# EasyEDA Pro project ReuseBlock_示波器通道_2025-12-05.epro

# Schematic 示波器通道

## Sheets
1 CH1: Create Date: 2024-11-14; Page Name: CH1; Project Name: OSC-chaosheng; Schematic Name: CH1/2; Update Date: 2024-11-22; Company: 嘉立创EDA; Page Size: A4; Version: V1.0
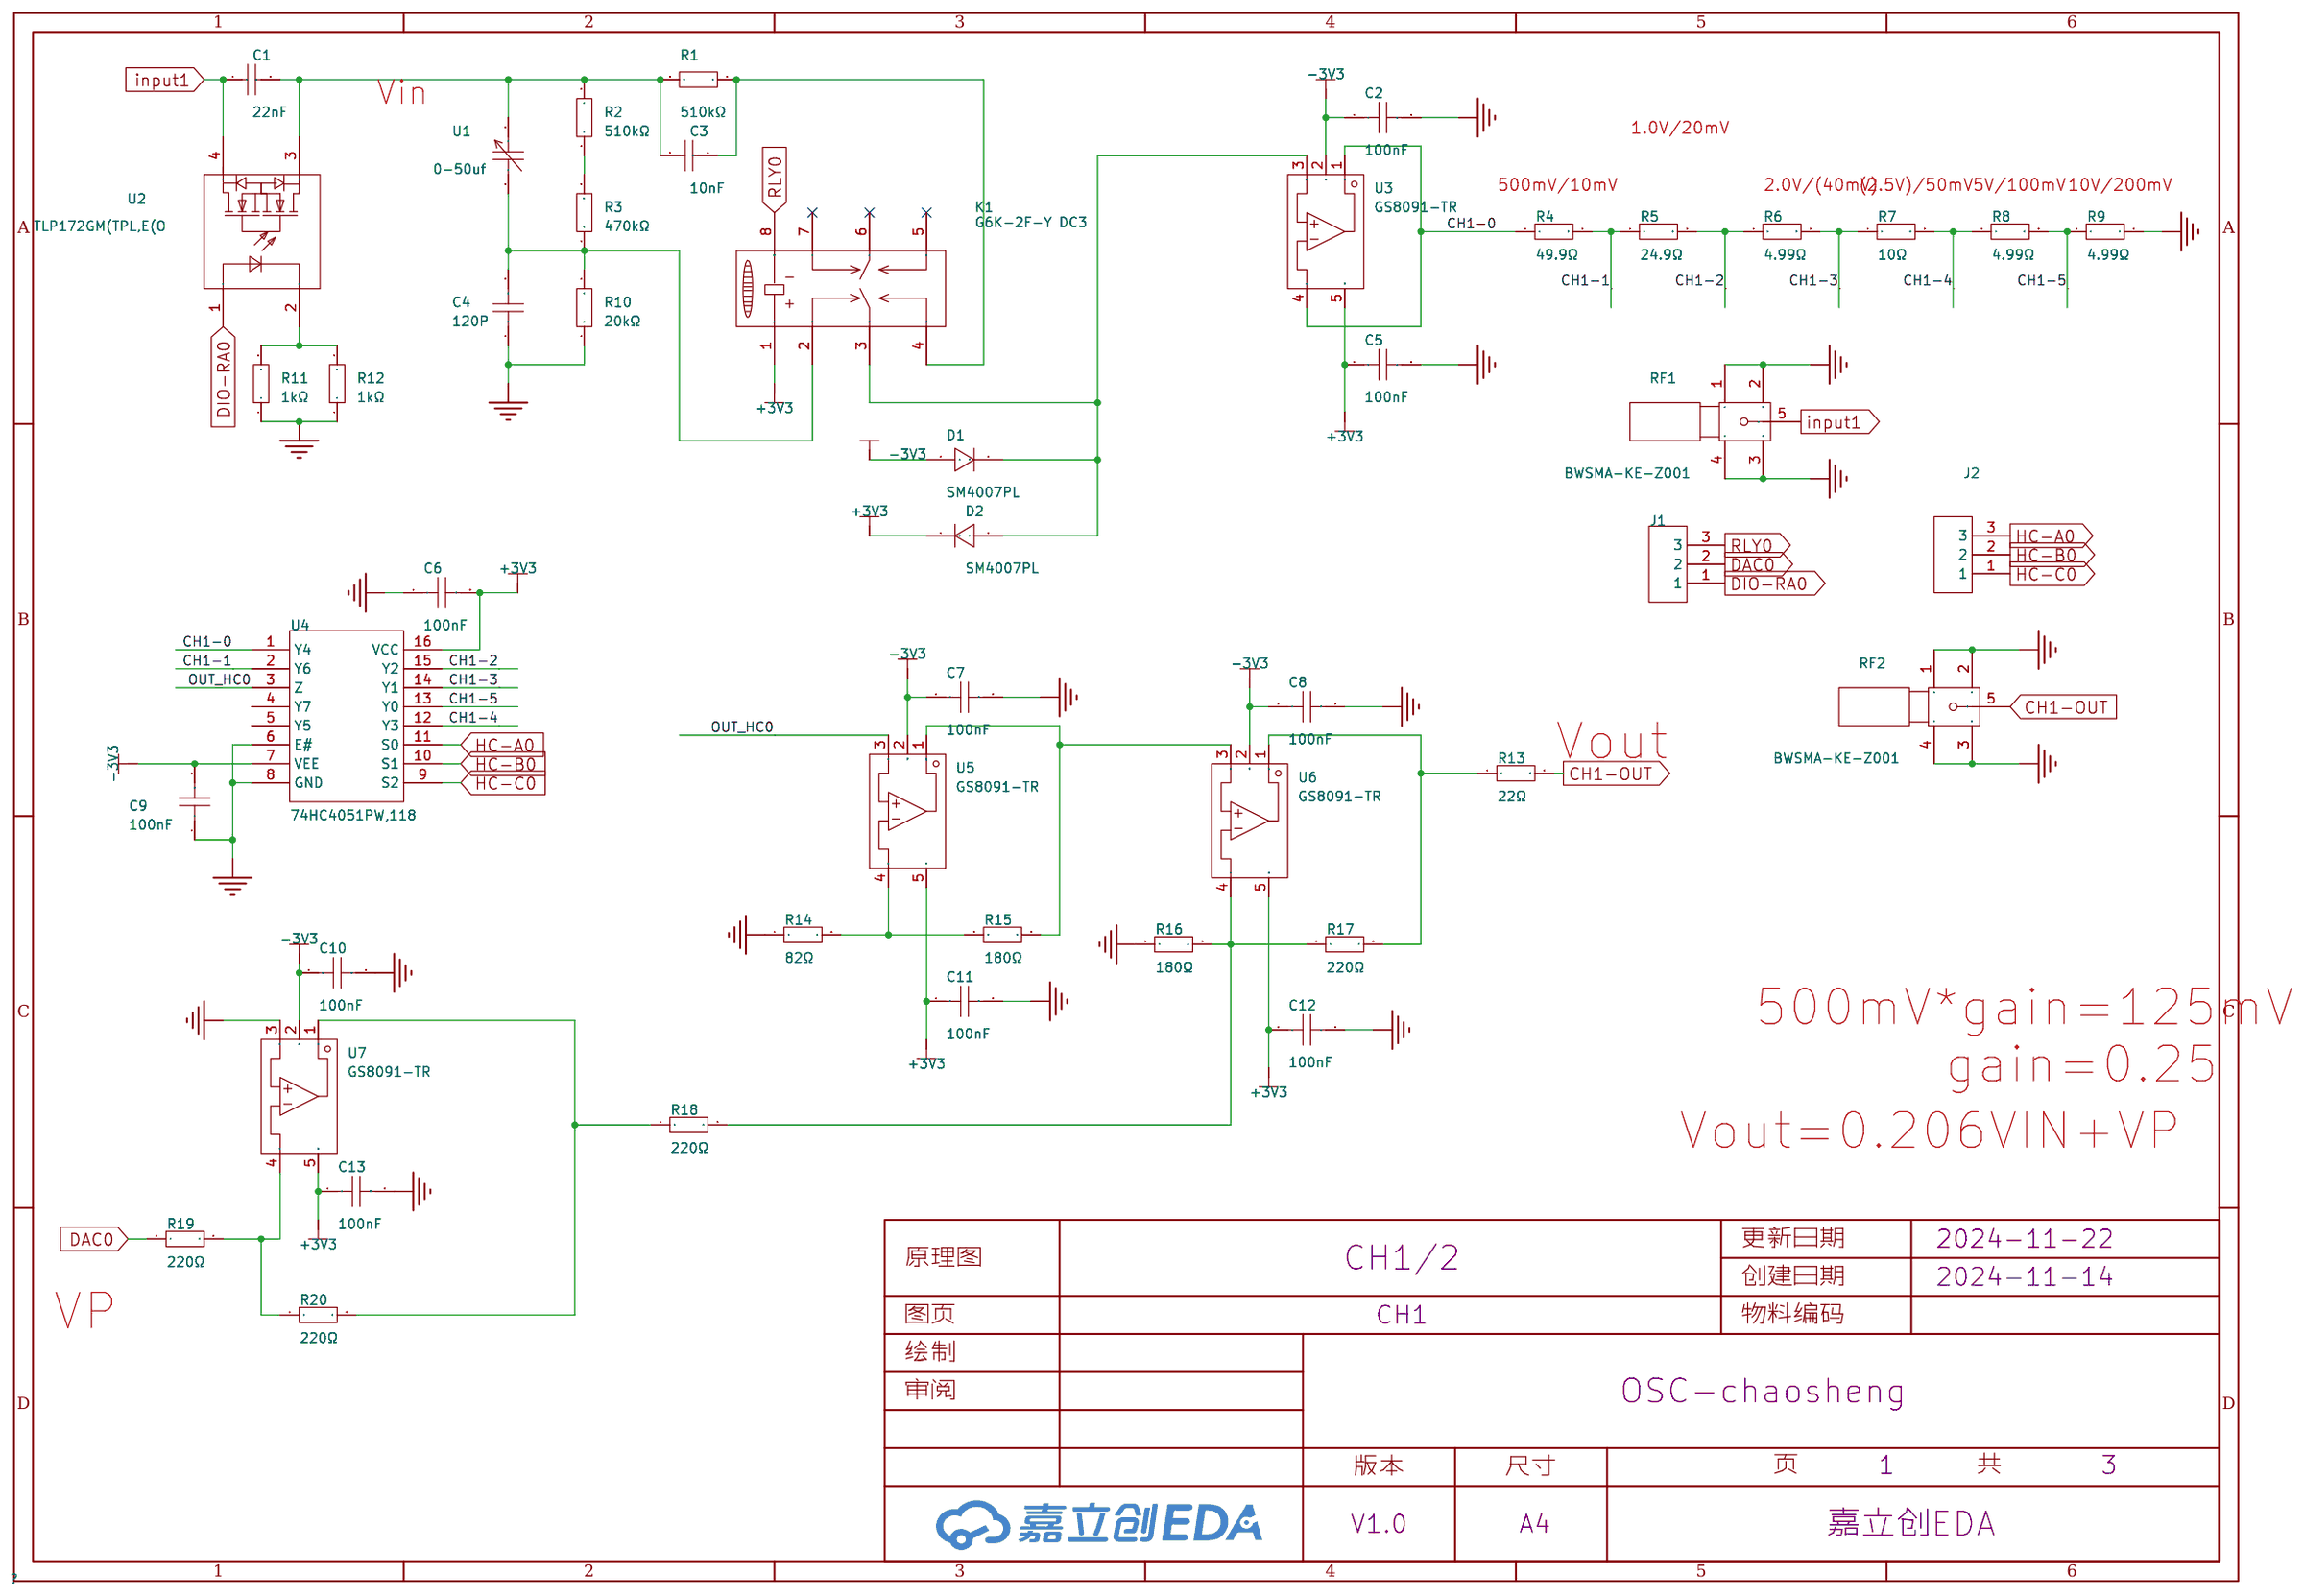
[diagram p0: CH1]
2 CH2: Page Name: CH2; Project Name: OSC1; Schematic Name: CH1/2_1; Update Date: 2024-11-14
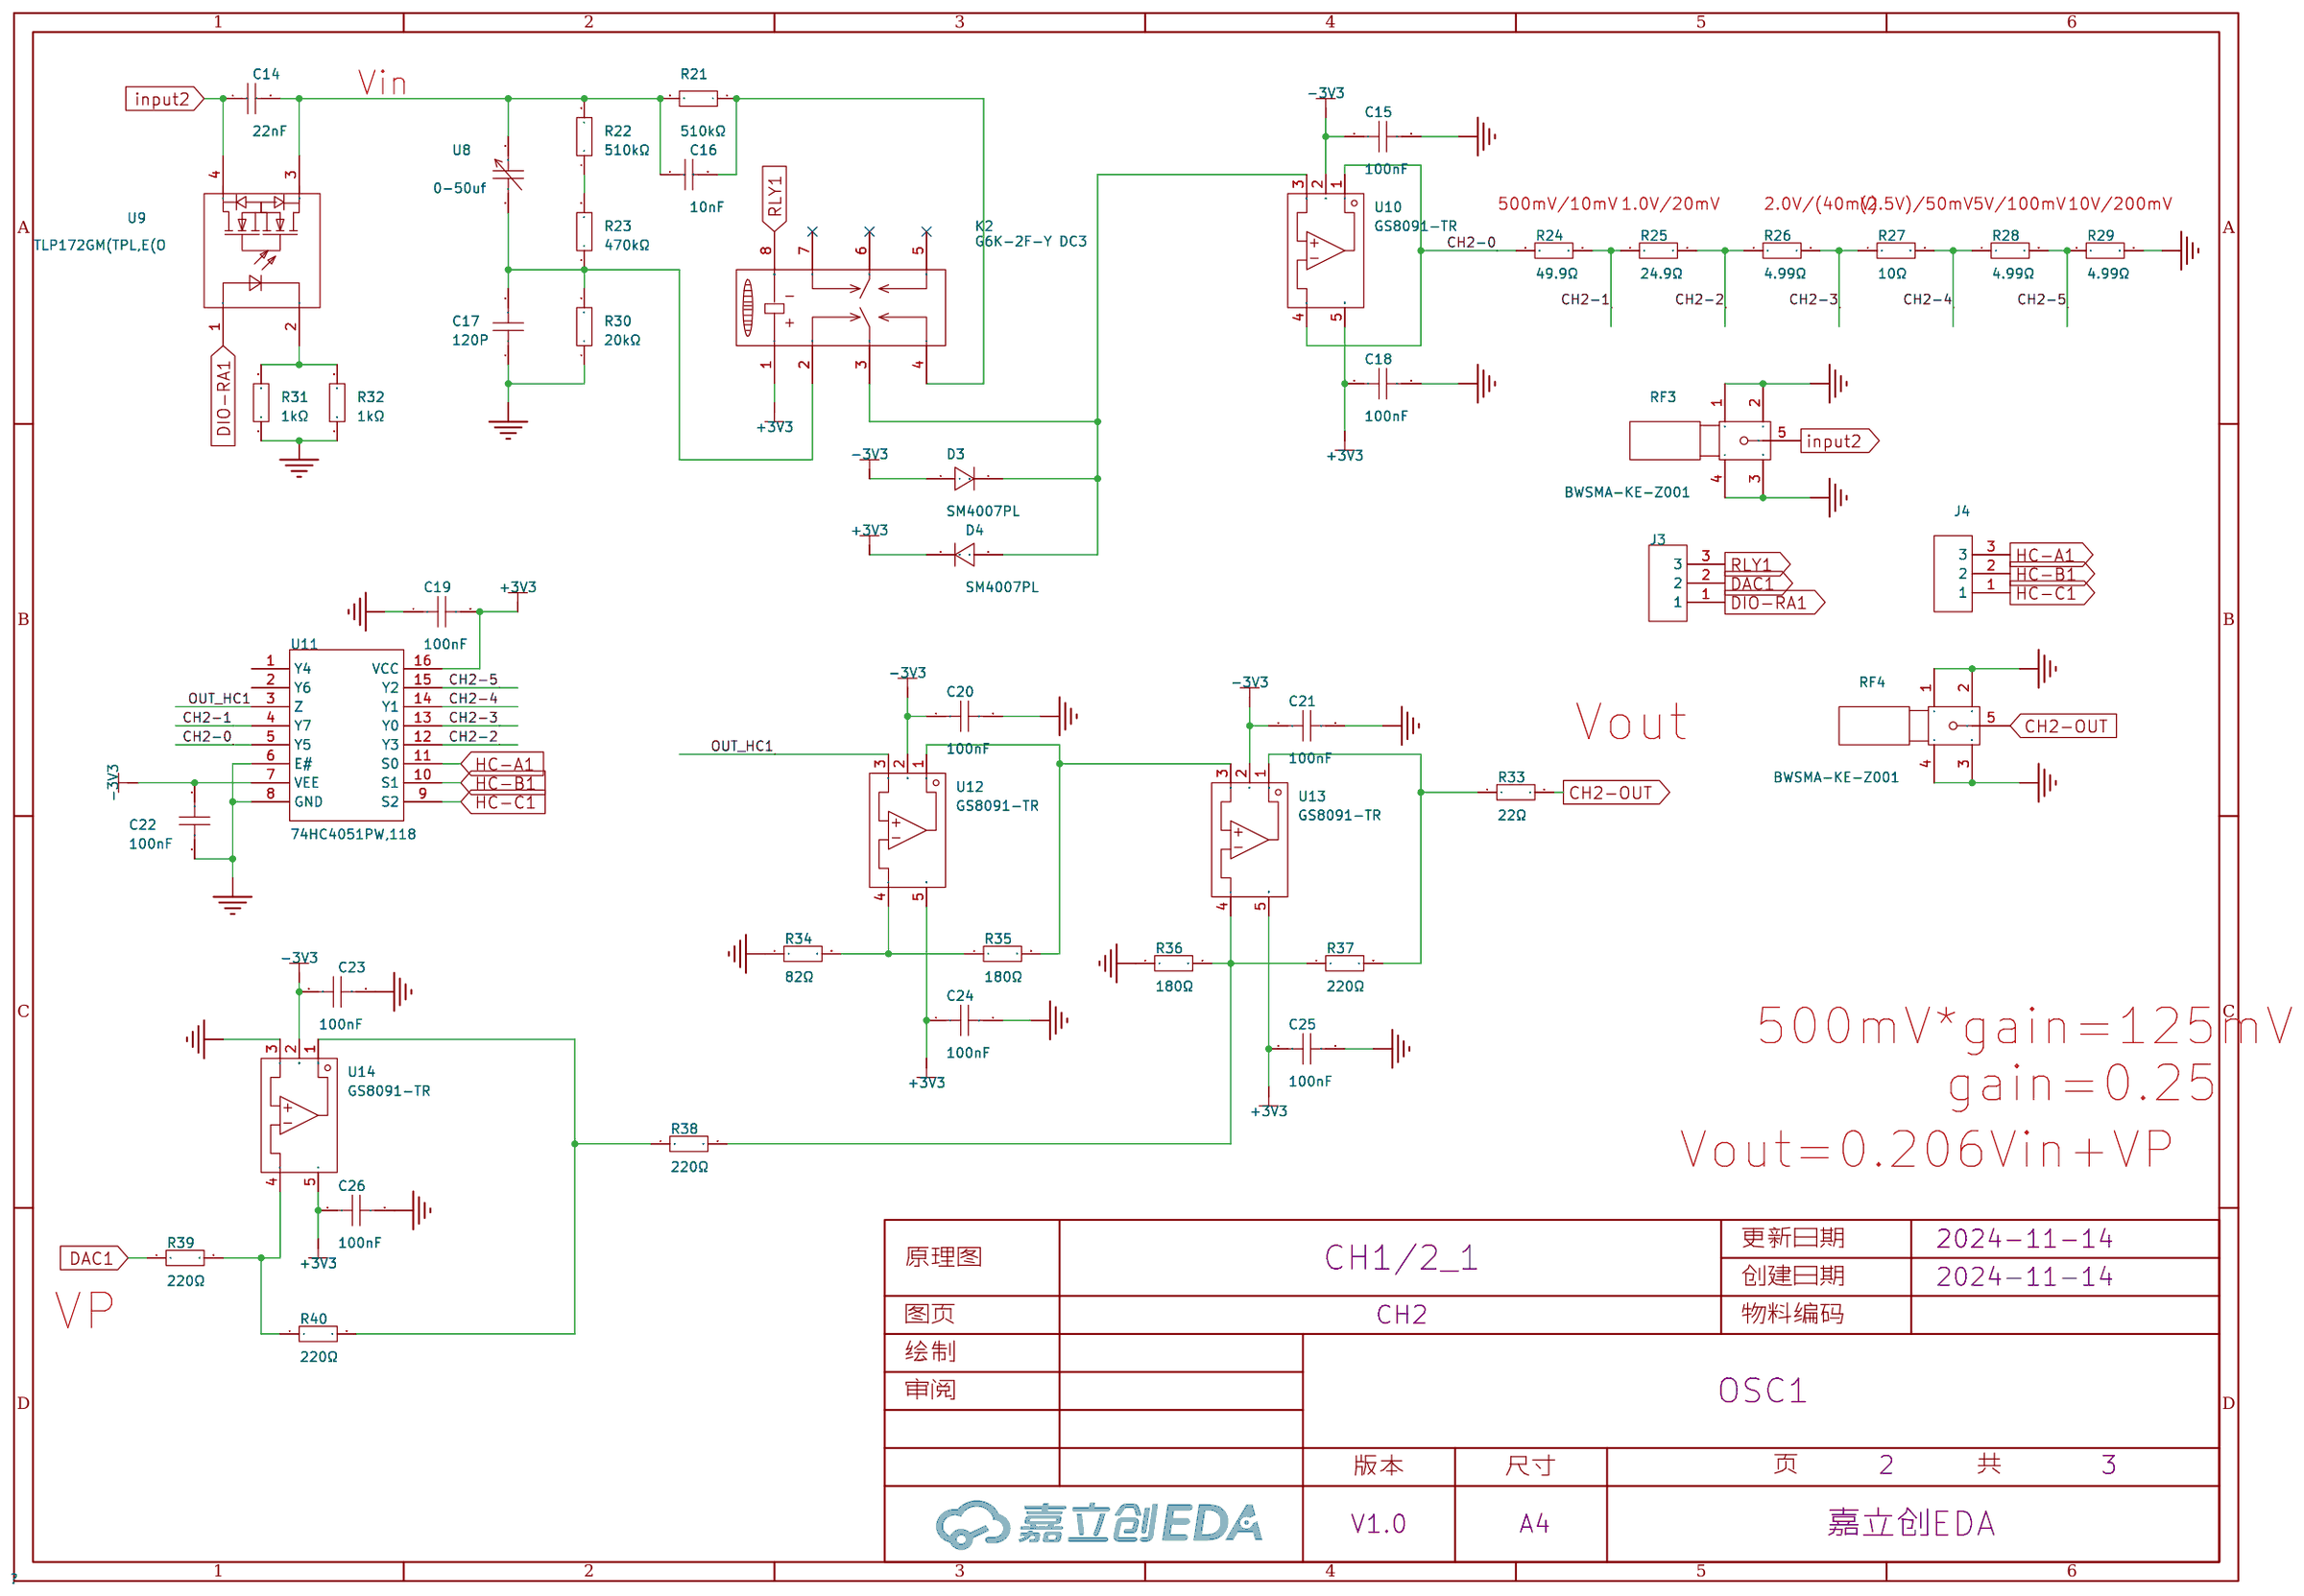
[diagram p1: CH2]
3 电源: Page Name: 电源; Project Name: OSC1; Schematic Name: CH1/2_1; Update Date: 2024-11-14
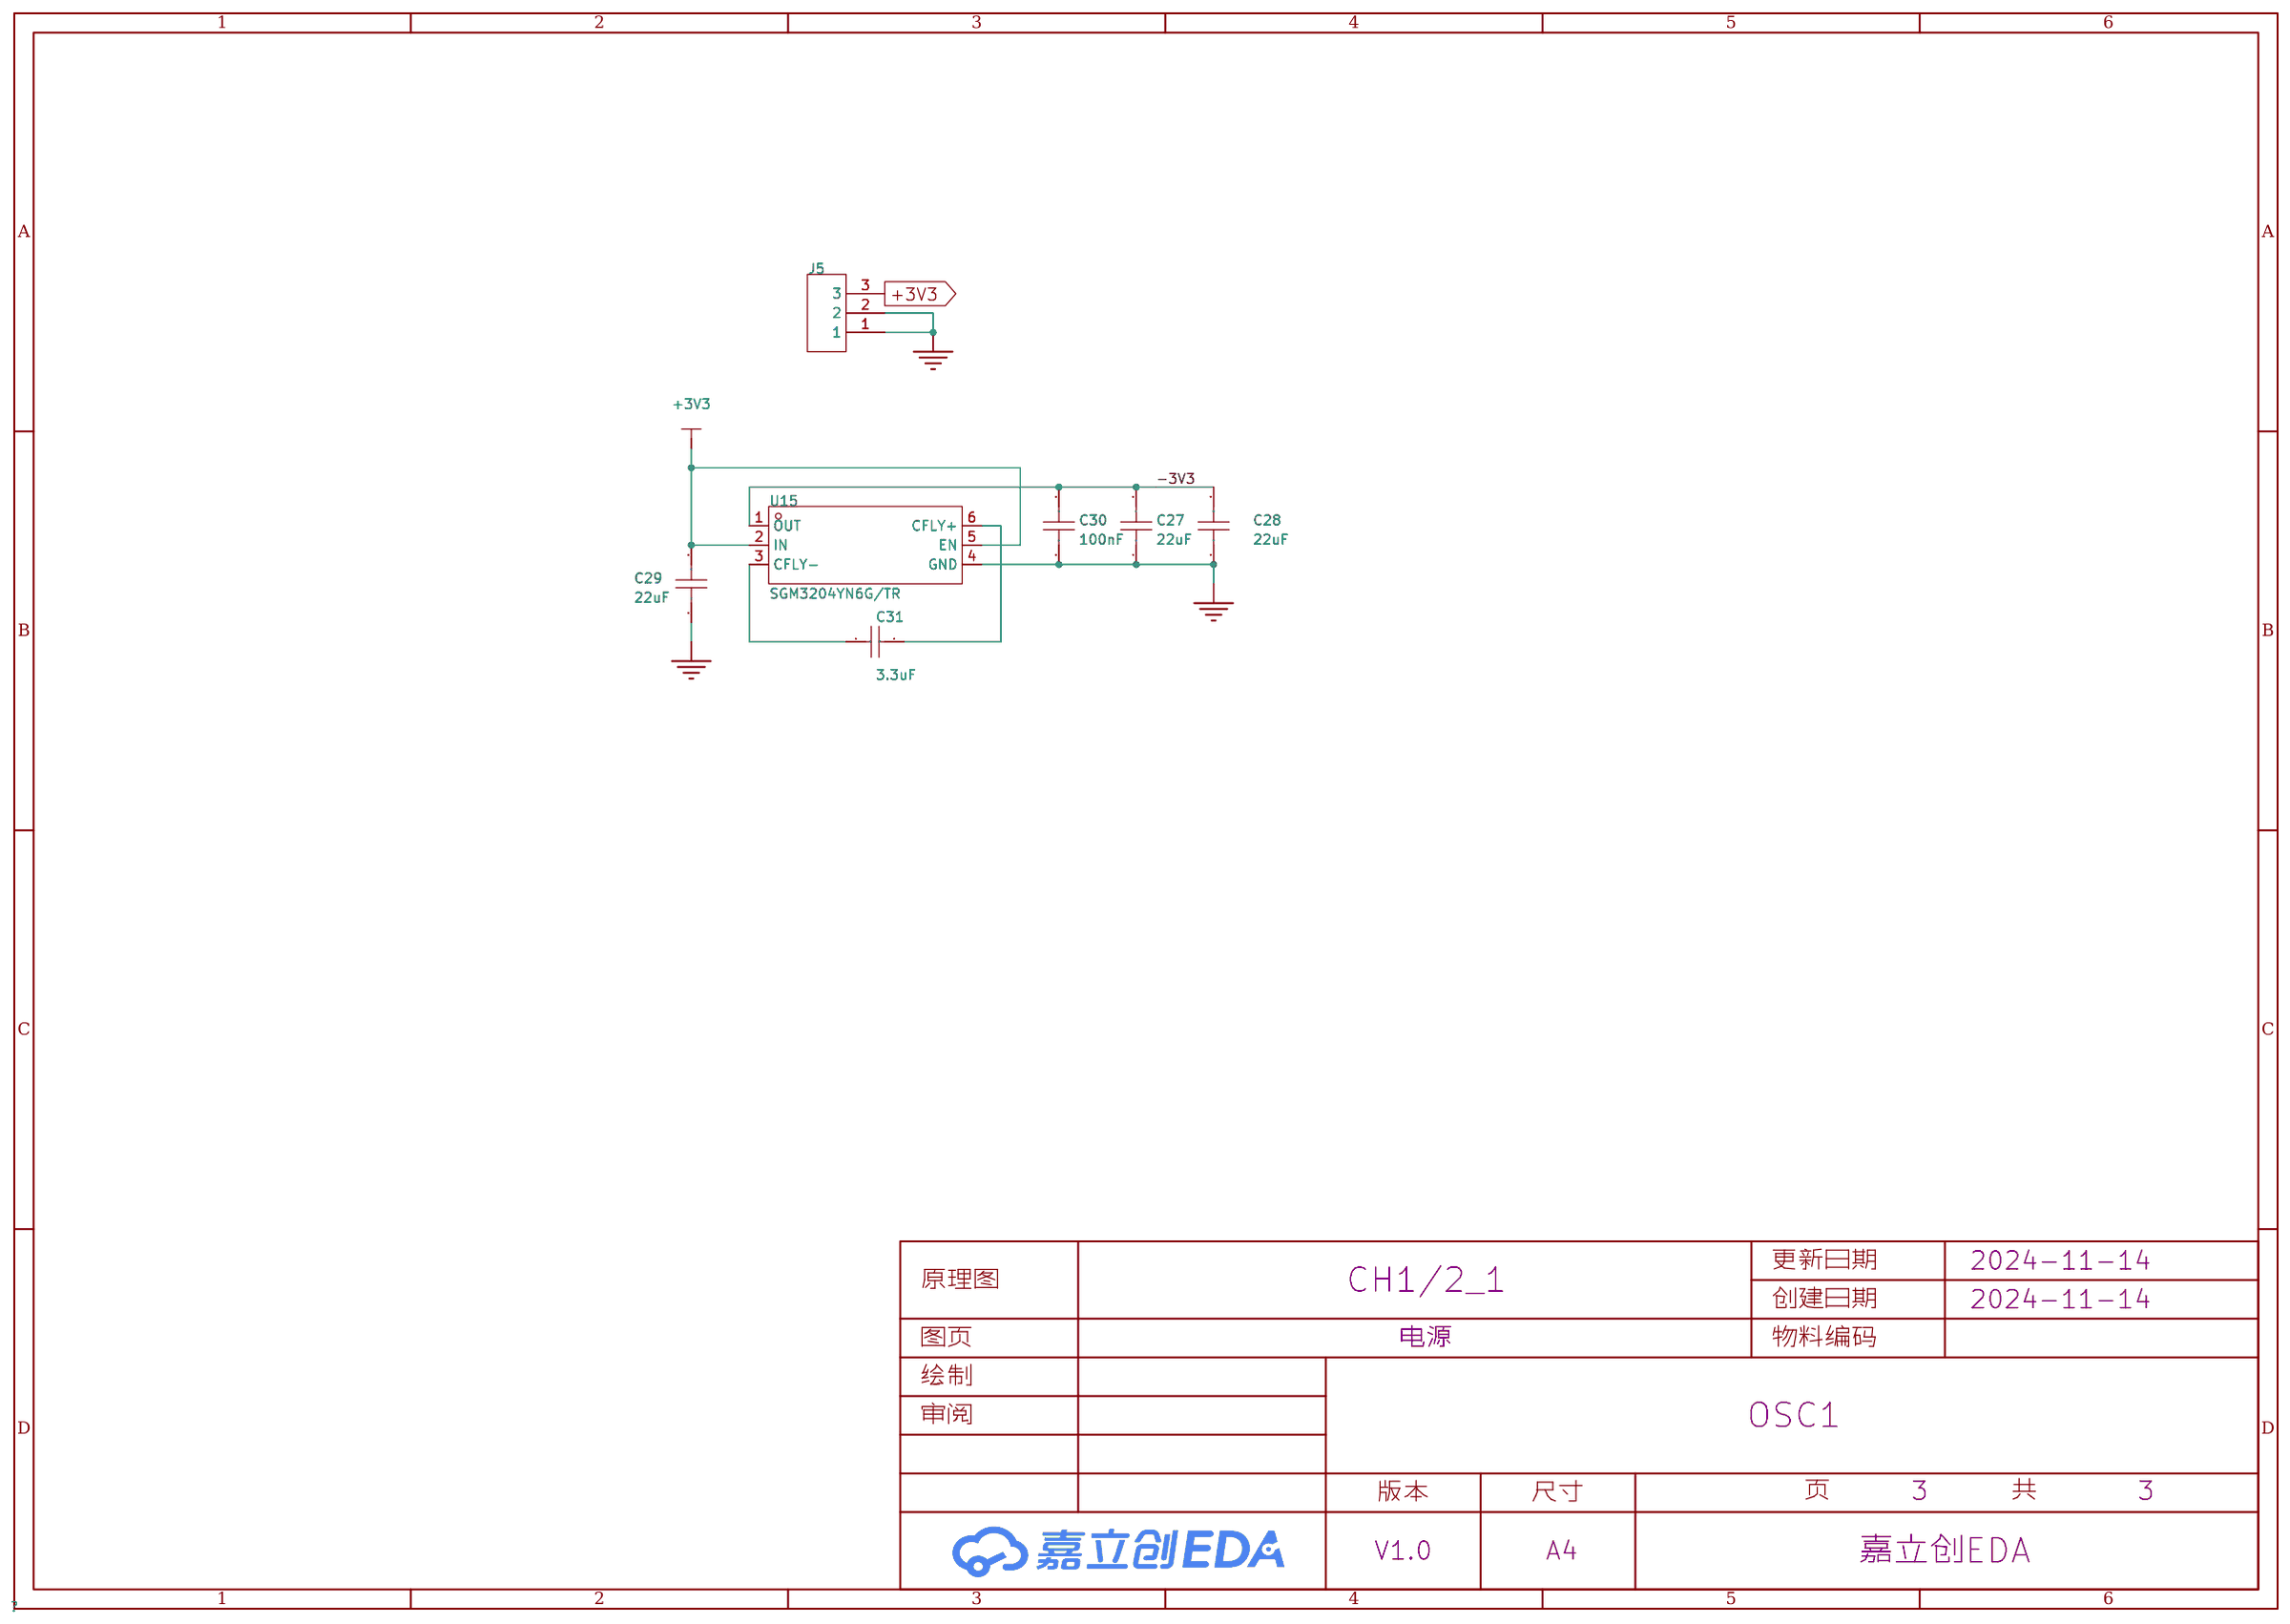
[diagram p2: 电源]

## Parts
sheet CH1
C1  22nF  [C0603]
C2  100nF  [C0402]
C3  10nF  [C0402]
C4  120P  [280*100mil]
C5  100nF  [C0402]
C6  100nF  [C0402]
C7  100nF  [C0402]
C8  100nF  [C0402]
C9  100nF  [C0402]
C10  100nF  [C0402]
C11  100nF  [C0402]
C12  100nF  [C0402]
C13  100nF  [C0402]
D1  SM4007PL  [SOD-123F_L2.8-W1.8-LS3.7-RD]
D2  SM4007PL  [SOD-123F_L2.8-W1.8-LS3.7-RD]
J1  -  [CH2.54-3插座]
J2  -  [CH2.54-3插座]
K1  G6K-2F-Y DC3  [RELAY-SMD_G6K-2F-Y]
R1  510kΩ  [R0402]
R2  510kΩ  [R0402]
R3  470kΩ  [R0402]
R4  49.9Ω  [R0402]
R5  24.9Ω  [R0402]
R6  4.99Ω  [R0402]
R7  10Ω  [R0402]
R8  4.99Ω  [R0402]
R9  4.99Ω  [R0402]
R10  20kΩ  [R0402]
R11  1kΩ  [R0402]
R12  1kΩ  [R0402]
R13  22Ω  [R0402]
R14  82Ω  [R0402]
R15  180Ω  [R0402]
R16  180Ω  [R0402]
R17  220Ω  [R0402]
R18  220Ω  [R0402]
R19  220Ω  [R0402]
R20  220Ω  [R0402]
RF1  BWSMA-KE-Z001  [SMA-TH_BWSMA-KE-Z001]
RF2  BWSMA-KE-Z001  [SMA-TH_BWSMA-KE-Z001]
U1  0-50uf  [可调电容]
U2  TLP172GM(TPL,E(O  [SMD-4_L4.6-W3.7-P2.54-LS7.0-BR]
U3  GS8091-TR  [SOT-23-5_L3.0-W1.7-P0.95-LS2.8-BR]
U4  74HC4051PW,118  [TSSOP-16_L5.0-W4.4-P0.65-LS6.4-BL]
U5  GS8091-TR  [SOT-23-5_L3.0-W1.7-P0.95-LS2.8-BR]
U6  GS8091-TR  [SOT-23-5_L3.0-W1.7-P0.95-LS2.8-BR]
U7  GS8091-TR  [SOT-23-5_L3.0-W1.7-P0.95-LS2.8-BR]
sheet CH2
C14  22nF  [C0603]
C15  100nF  [C0402]
C16  10nF  [C0402]
C17  120P  [280*100mil]
C18  100nF  [C0402]
C19  100nF  [C0402]
C20  100nF  [C0402]
C21  100nF  [C0402]
C22  100nF  [C0402]
C23  100nF  [C0402]
C24  100nF  [C0402]
C25  100nF  [C0402]
C26  100nF  [C0402]
D3  SM4007PL  [SOD-123F_L2.8-W1.8-LS3.7-RD]
D4  SM4007PL  [SOD-123F_L2.8-W1.8-LS3.7-RD]
J3  -  [CH2.54-3插座]
J4  -  [CH2.54-3插座]
K2  G6K-2F-Y DC3  [RELAY-SMD_G6K-2F-Y]
R21  510kΩ  [R0402]
R22  510kΩ  [R0402]
R23  470kΩ  [R0402]
R24  49.9Ω  [R0402]
R25  24.9Ω  [R0402]
R26  4.99Ω  [R0402]
R27  10Ω  [R0402]
R28  4.99Ω  [R0402]
R29  4.99Ω  [R0402]
R30  20kΩ  [R0402]
R31  1kΩ  [R0402]
R32  1kΩ  [R0402]
R33  22Ω  [R0402]
R34  82Ω  [R0402]
R35  180Ω  [R0402]
R36  180Ω  [R0402]
R37  220Ω  [R0402]
R38  220Ω  [R0402]
R39  220Ω  [R0402]
R40  220Ω  [R0402]
RF3  BWSMA-KE-Z001  [SMA-TH_BWSMA-KE-Z001]
RF4  BWSMA-KE-Z001  [SMA-TH_BWSMA-KE-Z001]
U8  0-50uf  [可调电容]
U9  TLP172GM(TPL,E(O  [SMD-4_L4.6-W3.7-P2.54-LS7.0-BR]
U10  GS8091-TR  [SOT-23-5_L3.0-W1.7-P0.95-LS2.8-BR]
U11  74HC4051PW,118  [TSSOP-16_L5.0-W4.4-P0.65-LS6.4-BL]
U12  GS8091-TR  [SOT-23-5_L3.0-W1.7-P0.95-LS2.8-BR]
U13  GS8091-TR  [SOT-23-5_L3.0-W1.7-P0.95-LS2.8-BR]
U14  GS8091-TR  [SOT-23-5_L3.0-W1.7-P0.95-LS2.8-BR]
sheet 电源
C27  22uF  [C0603]
C28  22uF  [C0603]
C29  22uF  [C0603]
C30  100nF  [C0402]
C31  3.3uF  [C0603]
J5  -  [CH2.54-3插座]
U15  SGM3204YN6G/TR  [SOT-23-6_L2.9-W1.6-P0.95-LS2.8-BR]

## Library data of the parts
C1 C14 = CL10B223KB8NNNC: 容值:22nF;精度:±10%;额定电压:50V;材质(温度系数):X7R;; LCSC Part Name: 22nF ±10% 50V; Supplier Part: C21122; Manufacturer: SAMSUNG(三星); Supplier Footprint: 0603; Datasheet: https://atta.szlcsc.com/upload/public/pdf/source/20160218/1457707763339.pdf; Supplier: LCSC; Tolerance: ±10%; Voltage Rated: 50V; Temperature Coefficient: X7R
C2 C5-C13 C15 C18-C26 = CL05B104KB54PNC: 容值:100nF;精度:±10%;额定电压:50V;材质(温度系数):X7R;; LCSC Part Name: 100nF ±10% 50V; Supplier Part: C307331; Manufacturer: SAMSUNG(三星); Supplier Footprint: 0402; JLCPCB Part Class: 基础库; Datasheet: https://atta.szlcsc.com/upload/public/pdf/source/20160218/1457707763339.pdf; Supplier: LCSC; Tolerance: ±10%; Voltage Rated: 50V; Temperature Coefficient: X7R
C3 C16 = CL05B103KB5NNNC: 容值:10nF;精度:±10%;额定电压:50V;材质(温度系数):X7R;; LCSC Part Name: 10nF ±10% 50V; Supplier Part: C15195; Manufacturer: SAMSUNG(三星); Supplier Footprint: 0402; Datasheet: https://atta.szlcsc.com/upload/public/pdf/source/20160218/1457707763339.pdf; Supplier: LCSC; Tolerance: ±10%; Voltage Rated: 50V; Temperature Coefficient: X7R
C4 C17 = 插件电容
D1-D4 = SM4007PL_C64898: 二极管配置:独立式;正向压降(Vf):1.1V@1A;直流反向耐压(Vr):1kV;整流电流:1A;; LCSC Part Name: 电压:1kV 电流:1A; Supplier Part: C64898; Manufacturer: MDD(辰达半导体); Supplier Footprint: SOD-123FL; Datasheet: https://atta.szlcsc.com/upload/public/pdf/source/20230823/16A8FDE162764C9B685A3717F2DA3690.pdf; Supplier: LCSC; Diode Configuration: 独立式; Forward Voltage (Vf@If): 1.1V@1A; Reverse Voltage (Vr): 1kV; Rectified Current: 1A; Reverse Leakage Current: 10uA@1kV
J1-J5 = HDR-3P
K1 K2 = G6K-2F-Y DC3: 线圈电压:-;触点形式:-;触点容量(电阻负载):-;最大切换电压:-;最大切换电流:-;; LCSC Part Name: G6K-2F-Y 3VDC; Supplier Part: C93168; Manufacturer: OMRON(欧姆龙); Supplier Footprint: SMD,6.5x10mm; JLCPCB Part Class: 扩展库; Datasheet: https://atta.szlcsc.com/upload/public/pdf/source/20220125/C1876770_53E5491D4B68F29C4BBD8118E9BAE0E8.pdf; Supplier: LCSC
R1 R2 R21 R22 = 0402WGF5103TCE: 电阻类型:厚膜电阻;阻值:510kΩ;精度:±1%;功率:62.5mW;最大工作电压:50V;温度系数:±100ppm/℃;; LCSC Part Name: 510kΩ ±1% 62.5mW 厚膜电阻; Supplier Part: C11616; Manufacturer: UNI-ROYAL(厚声); Supplier Footprint: 0402; Datasheet: https://atta.szlcsc.com/upload/public/pdf/source/20200306/C422600_1E6D84923E4A46A82E41ADD87F860B5C.pdf; Supplier: LCSC; Type: 厚膜电阻; Tolerance: ±1%; Power(Watts): 62.5mW; Overload Voltage (Max): 50V; Temperature Coefficient: ±100ppm/℃; Operating Temperature Range: -55℃~+155℃
R3 R23 = 0402WGF4703TCE: 电阻类型:厚膜电阻;阻值:470kΩ;精度:±1%;功率:62.5mW;最大工作电压:50V;温度系数:±100ppm/℃;; LCSC Part Name: 470kΩ ±1% 62.5mW 厚膜电阻; Supplier Part: C25790; Manufacturer: UNI-ROYAL(厚声); Supplier Footprint: 0402; Datasheet: https://atta.szlcsc.com/upload/public/pdf/source/20200306/C422600_1E6D84923E4A46A82E41ADD87F860B5C.pdf; Supplier: LCSC; Type: 厚膜电阻; Tolerance: ±1%; Power(Watts): 62.5mW; Overload Voltage (Max): 50V; Temperature Coefficient: ±100ppm/℃; Operating Temperature Range: -55℃~+155℃
R4 R24 = 0402WGF499JTCE: 电阻类型:厚膜电阻;阻值:49.9Ω;精度:±1%;功率:62.5mW;最大工作电压:50V;温度系数:±100ppm/℃;; LCSC Part Name: 49.9Ω ±1% 62.5mW 厚膜电阻; Supplier Part: C25120; Manufacturer: UNI-ROYAL(厚声); Supplier Footprint: 0402; JLCPCB Part Class: 基础库; Datasheet: https://atta.szlcsc.com/upload/public/pdf/source/20200306/C422600_1E6D84923E4A46A82E41ADD87F860B5C.pdf; Supplier: LCSC; Type: 厚膜电阻; Tolerance: ±1%; Power(Watts): 62.5mW; Overload Voltage (Max): 50V; Temperature Coefficient: ±100ppm/℃; Operating Temperature Range: -55℃~+155℃
R5 R25 = 0402WGF249JTCE: 电阻类型:厚膜电阻;阻值:24.9Ω;精度:±1%;功率:62.5mW;最大工作电压:50V;温度系数:±200ppm/℃;; LCSC Part Name: 24.9Ω ±1% 62.5mW 厚膜电阻; Supplier Part: C5099; Manufacturer: UNI-ROYAL(厚声); Supplier Footprint: 0402; JLCPCB Part Class: 扩展库; Datasheet: https://atta.szlcsc.com/upload/public/pdf/source/20200306/C422600_1E6D84923E4A46A82E41ADD87F860B5C.pdf; Supplier: LCSC; Type: 厚膜电阻; Tolerance: ±1%; Power(Watts): 62.5mW; Overload Voltage (Max): 50V; Temperature Coefficient: ±200ppm/℃; Operating Temperature Range: -55℃~+155℃
R6 R8 R9 R26 R28 R29 = 0402WGF499KTCE: 电阻类型:厚膜电阻;阻值:4.99Ω;精度:±1%;功率:62.5mW;最大工作电压:50V;温度系数:±400ppm/℃;; LCSC Part Name: 4.99Ω ±1% 62.5mW 厚膜电阻; Supplier Part: C25122; Manufacturer: UNI-ROYAL(厚声); Supplier Footprint: 0402; JLCPCB Part Class: 扩展库; Datasheet: https://atta.szlcsc.com/upload/public/pdf/source/20200306/C422600_1E6D84923E4A46A82E41ADD87F860B5C.pdf; Supplier: LCSC; Type: 厚膜电阻; Tolerance: ±1%; Power(Watts): 62.5mW; Overload Voltage (Max): 50V; Temperature Coefficient: ±400ppm/℃; Operating Temperature Range: -55℃~+155℃
R7 R27 = 0402WGF100JTCE: 电阻类型:厚膜电阻;阻值:10Ω;精度:±1%;功率:62.5mW;最大工作电压:50V;温度系数:±200ppm/℃;; LCSC Part Name: 10Ω ±1% 62.5mW 厚膜电阻; Supplier Part: C25077; Manufacturer: UNI-ROYAL(厚声); Supplier Footprint: 0402; Datasheet: https://atta.szlcsc.com/upload/public/pdf/source/20200306/C422600_1E6D84923E4A46A82E41ADD87F860B5C.pdf; Supplier: LCSC; Type: 厚膜电阻; Tolerance: ±1%; Power(Watts): 62.5mW; Overload Voltage (Max): 50V; Temperature Coefficient: ±200ppm/℃; Operating Temperature Range: -55℃~+155℃
R10 R30 = 0402WGF2002TCE: 电阻类型:厚膜电阻;阻值:20kΩ;精度:±1%;功率:62.5mW;最大工作电压:50V;温度系数:±100ppm/℃;; LCSC Part Name: 20kΩ ±1% 62.5mW 厚膜电阻; Supplier Part: C25765; Manufacturer: UNI-ROYAL(厚声); Supplier Footprint: 0402; Datasheet: https://atta.szlcsc.com/upload/public/pdf/source/20200306/C422600_1E6D84923E4A46A82E41ADD87F860B5C.pdf; Supplier: LCSC; Type: 厚膜电阻; Tolerance: ±1%; Power(Watts): 62.5mW; Overload Voltage (Max): 50V; Temperature Coefficient: ±100ppm/℃; Operating Temperature Range: -55℃~+155℃
R11 R12 R31 R32 = 0402WGF1001TCE: 电阻类型:厚膜电阻;阻值:1kΩ;精度:±1%;功率:62.5mW;最大工作电压:50V;温度系数:±100ppm/℃;; LCSC Part Name: 1kΩ ±1% 62.5mW 厚膜电阻; Supplier Part: C11702; Manufacturer: UNI-ROYAL(厚声); Supplier Footprint: 0402; Datasheet: https://atta.szlcsc.com/upload/public/pdf/source/20200306/C422600_1E6D84923E4A46A82E41ADD87F860B5C.pdf; Supplier: LCSC; Type: 厚膜电阻; Tolerance: ±1%; Power(Watts): 62.5mW; Overload Voltage (Max): 50V; Temperature Coefficient: ±100ppm/℃; Operating Temperature Range: -55℃~+155℃
R13 R33 = 0402WGF220JTCE: 电阻类型:厚膜电阻;阻值:22Ω;精度:±1%;功率:62.5mW;最大工作电压:50V;温度系数:±100ppm/℃;; LCSC Part Name: 22Ω ±1% 62.5mW 厚膜电阻; Supplier Part: C25092; Manufacturer: UNI-ROYAL(厚声); Supplier Footprint: 0402; JLCPCB Part Class: 基础库; Datasheet: https://atta.szlcsc.com/upload/public/pdf/source/20200306/C422600_1E6D84923E4A46A82E41ADD87F860B5C.pdf; Supplier: LCSC; Type: 厚膜电阻; Tolerance: ±1%; Power(Watts): 62.5mW; Overload Voltage (Max): 50V; Temperature Coefficient: ±100ppm/℃; Operating Temperature Range: -55℃~+155℃
R14 R34 = 0402WGF820JTCE: 电阻类型:厚膜电阻;阻值:82Ω;精度:±1%;功率:62.5mW;最大工作电压:50V;温度系数:±200ppm/℃;; LCSC Part Name: 82Ω ±1% 62.5mW 厚膜电阻; Supplier Part: C25136; Manufacturer: UNI-ROYAL(厚声); Supplier Footprint: 0402; JLCPCB Part Class: 扩展库; Datasheet: https://atta.szlcsc.com/upload/public/pdf/source/20200306/C422600_1E6D84923E4A46A82E41ADD87F860B5C.pdf; Supplier: LCSC; Type: 厚膜电阻; Tolerance: ±1%; Power(Watts): 62.5mW; Overload Voltage (Max): 50V; Temperature Coefficient: ±200ppm/℃; Operating Temperature Range: -55℃~+155℃
R15 R16 R35 R36 = 0402WGF1800TCE: 电阻类型:厚膜电阻;阻值:180Ω;精度:±1%;功率:62.5mW;最大工作电压:50V;温度系数:±100ppm/℃;; LCSC Part Name: 180Ω ±1% 62.5mW 厚膜电阻; Supplier Part: C38941; Manufacturer: UNI-ROYAL(厚声); Supplier Footprint: 0402; JLCPCB Part Class: 扩展库; Datasheet: https://atta.szlcsc.com/upload/public/pdf/source/20200306/C422600_1E6D84923E4A46A82E41ADD87F860B5C.pdf; Supplier: LCSC; Type: 厚膜电阻; Tolerance: ±1%; Power(Watts): 62.5mW; Overload Voltage (Max): 50V; Temperature Coefficient: ±100ppm/℃; Operating Temperature Range: -55℃~+155℃
R17-R20 R37-R40 = 0402WGF2200TCE: 电阻类型:厚膜电阻;阻值:220Ω;精度:±1%;功率:62.5mW;最大工作电压:50V;温度系数:±100ppm/℃;; LCSC Part Name: 220Ω ±1% 62.5mW 厚膜电阻; Supplier Part: C25091; Manufacturer: UNI-ROYAL(厚声); Supplier Footprint: 0402; JLCPCB Part Class: 基础库; Datasheet: https://atta.szlcsc.com/upload/public/pdf/source/20200306/C422600_1E6D84923E4A46A82E41ADD87F860B5C.pdf; Supplier: LCSC; Type: 厚膜电阻; Tolerance: ±1%; Power(Watts): 62.5mW; Overload Voltage (Max): 50V; Temperature Coefficient: ±100ppm/℃; Operating Temperature Range: -55℃~+155℃
RF1-RF4 = BWSMA-KE-Z001_C496549: 连接器类型:板端;接口类型:内孔;端口数量:1;接口直径:-;接口长度/高度:-;频率-最大值:-;射频系列:SMA;阻抗:50Ω;样式:正脚;触头材质:-;触头镀层:-;工作温度范围:-65℃~+165℃;焊接温度(最大值):-;; LCSC Part Name: 内孔 SMA 正脚; Supplier Part: C496549; Manufacturer: BAT WIRELESS(蝙蝠无线); Supplier Footprint: 插件; Datasheet: https://atta.szlcsc.com/upload/public/pdf/source/20221228/40BF41E56A06003A0210E1785CA66EA6.pdf; Supplier: LCSC; Connector Type: 板端; Interface Type: 内孔; Number of Ports: 1; RF Series: SMA; Impedance: 50Ω; Style: 正脚; Operating Temperature Range: -65℃~+165℃
U1 U8 = 0-50uf可调电容
U2 U9 = TLP172GM(TPL,E(O: 继电器触点形式:1 Form A(SPST-NO);适用负载类型:AC,DC;正向压降:1.27V;负载电压:350V;连续负载电流:110mA;导通电阻:22Ω;; LCSC Part Name: 1 Form A(SPSTNO) 负载AC,DC 负载电压350V; Supplier Part: C261926; Manufacturer: TOSHIBA(东芝); Supplier Footprint: SOP-4-2.54mm; Datasheet: https://atta.szlcsc.com/upload/public/pdf/source/20180801/C261926_98E6F8A0917C7E31AE8EC16F9B9F81C3.pdf; Supplier: LCSC; Relay Contact Form: 1 Form A(SPST-NO); Load Type: AC,DC; Input Forward Voltage: 1.27V; Voltage - Load: 350V; Continuous Load Current: 110mA; On Resistance: 22Ω; Isolation Voltage(rms): 3.75kV; Turn-on time: 500us; Turn-off time: 100us
U3 U5-U7 U10 U12-U14 = GS8091-TR: 放大器数:单路;增益带宽积(GBP):180MHz;输入偏置电流(Ib):1pA;输入失调电压(Vos):2mV;压摆率(SR):206V/us;带宽(-3db):350MHz;; LCSC Part Name: GS8091 SOT-23-5; Supplier Part: C157724; Manufacturer: Gainsil(聚洵); Supplier Footprint: SOT-23-5; JLCPCB Part Class: 扩展库; Datasheet: https://atta.szlcsc.com/upload/public/pdf/source/20220610/E3748DDE2830B859623FB1BDA24ABCCF.pdf; Supplier: LCSC; Number of Circuits: 单路; Gain Bandwidth Product(GBP): 180MHz; Current - Input Bias(Ib): 1pA; Voltage - Input Offset(Vos): 2mV; Slew Rate(SR): 206V/us; Supply Voltage: -；-；-; -3db Bandwidth: 350MHz; Supply Current: 4.2mA
U4 U11 = 74HC4051PW,118: 通道数:1;导通电阻(Ron@VCC):120Ω;; Supplier Part: C5645; Manufacturer: Nexperia(安世); Supplier Footprint: TSSOP-16; JLCPCB Part Class: 扩展库; Datasheet: https://atta.szlcsc.com/upload/public/pdf/source/20120413/1457706470089.pdf; Supplier: LCSC; Number of Channels: 1; Supply Voltage: 2V~10V; Turn-on time: 51ns; On-State Resistance (Max): 120Ω; Turn-off time: 42ns
C27-C29 = CL10A226MQ8NRNC: 容值:22uF;精度:±20%;额定电压:6.3V;材质(温度系数):X5R;; LCSC Part Name: 22uF ±20% 6.3V; Supplier Part: C59461; Manufacturer: SAMSUNG(三星); Supplier Footprint: 0603; Datasheet: https://atta.szlcsc.com/upload/public/pdf/source/20160218/1457707763339.pdf; Supplier: LCSC; Tolerance: ±20%; Voltage Rated: 6.3V; Temperature Coefficient: X5R
C30 = CL05B104KO5NNNC: 容值:100nF;精度:±10%;额定电压:16V;材质(温度系数):X7R;; LCSC Part Name: 100nF ±10% 16V; Supplier Part: C1525; Manufacturer: SAMSUNG(三星); Supplier Footprint: 0402; JLCPCB Part Class: 基础库; Datasheet: https://atta.szlcsc.com/upload/public/pdf/source/20160218/1457707763339.pdf; Supplier: LCSC; Tolerance: ±10%; Voltage Rated: 16V; Temperature Coefficient: X7R
C31 = CL10A335KP8NNNC: 容值:3.3uF;精度:±10%;额定电压:10V;材质(温度系数):X5R;; LCSC Part Name: 3.3uF ±10% 10V; Supplier Part: C51412; Manufacturer: SAMSUNG(三星); Supplier Footprint: 0603; Datasheet: https://atta.szlcsc.com/upload/public/pdf/source/20160218/1457707763339.pdf; Supplier: LCSC; Tolerance: ±10%; Voltage Rated: 10V; Temperature Coefficient: X5R
U15 = SGM3204YN6G/TR: 电荷泵芯片，开关电容式电压变换器，最大输出200mA,可用于运放放大、滤波等电路; Supplier Part: C194031; Manufacturer: SGMICRO(圣邦微); Supplier Footprint: SOT-23-6; JLCPCB Part Class: 扩展库; Datasheet: https://atta.szlcsc.com/upload/public/pdf/source/20180627/C194031_755051E53122D645C36CF727711B963E.pdf; Supplier: LCSC

## Nets
+3V3: C5.1 C6.2 C11.1 C12.1 C13.1 C18.1 C19.2 C24.1 C25.1 C26.1 C29.2 D2.1(C) D4.1(C) J5.3 K1.1 K2.1 U3.5(VDD) U4.16(VCC) U5.5(VDD) U6.5(VDD) U7.5(VDD) U10.5(VDD) U11.16(VCC) U12.5(VDD) U13.5(VDD) U14.5(VDD) U15.2(IN) U15.5(EN)
-3V3: C2.1 C7.1 C8.1 C9.2 C10.1 C15.1 C20.1 C21.1 C22.2 C23.1 C27.2 C28.2 C30.2 D1.2(A) D3.2(A) U3.2(VSS) U4.7(VEE) U5.2(VSS) U6.2(VSS) U7.2(VSS) U10.2(VSS) U11.7(VEE) U12.2(VSS) U13.2(VSS) U14.2(VSS) U15.1(OUT)
GND: C2.2 C4.1 C5.2 C6.1 C7.2 C8.2 C9.1 C10.2 C11.2 C12.2 C13.2 C15.2 C17.1 C18.2 C19.1 C20.2 C21.2 C22.1 C23.2 C24.2 C25.2 C26.2 C27.1 C28.1 C29.1 C30.1 J5.1 J5.2 R9.2 R10.1 R11.1 R12.1 R14.1 R16.1 R29.2 R30.1 R31.1 R32.1 R34.1 R36.1 RF1.1 RF1.2 RF1.3 RF1.4 RF2.1 RF2.2 RF2.3 RF2.4 RF3.1 RF3.2 RF3.3 RF3.4 RF4.1 RF4.2 RF4.3 RF4.4 U4.6(E#) U4.8(GND) U7.3(IN+) U11.6(E#) U11.8(GND) U14.3(IN+) U15.4(GND)
CH1-0: R4.1 U3.1(OUT) U3.4(IN-) U4.1(Y4)
CH1-1: R4.2 R5.1 U4.2(Y6)
CH1-2: R5.2 R6.1 U4.15(Y2)
CH1-3: R6.2 R7.1 U4.14(Y1)
CH1-4: R7.2 R8.1 U4.12(Y3)
CH1-5: R8.2 R9.1 U4.13(Y0)
CH1-OUT: R13.2 RF2.5
CH2-0: R24.1 U10.1(OUT) U10.4(IN-) U11.5(Y5)
CH2-1: R24.2 R25.1 U11.4(Y7)
CH2-2: R25.2 R26.1 U11.12(Y3)
CH2-3: R26.2 R27.1 U11.13(Y0)
CH2-4: R27.2 R28.1 U11.14(Y1)
CH2-5: R28.2 R29.1 U11.15(Y2)
CH2-OUT: R33.2 RF4.5
DAC0: J1.2 R19.1
DAC1: J3.2 R39.1
DIO-RA0: J1.1 U2.1
DIO-RA1: J3.1 U9.1
HC-A0: J2.3 U4.11(S0)
HC-A1: J4.3 U11.11(S0)
HC-B0: J2.2 U4.10(S1)
HC-B1: J4.2 U11.10(S1)
HC-C0: J2.1 U4.9(S2)
HC-C1: J4.1 U11.9(S2)
input1: C1.1 RF1.5 U2.4
input2: C14.1 RF3.5 U9.4
OUT_HC0: U4.3(Z) U5.3(IN+)
OUT_HC1: U11.3(Z) U12.3(IN+)
RLY0: J1.3 K1.8
RLY1: J3.3 K2.8
$1N1760: R11.2 R12.2 U2.2
$1N2407: C4.2 K1.2 R3.1 R10.2 U1.1
$1N11061: D1.1(C) D2.2(A) K1.3 U3.3(IN+)
$1N11884: R15.2 U5.1(OUT) U6.3(IN+)
$1N12026: R13.1 R17.2 U6.1(OUT)
$1N12901: R14.2 R15.1 U5.4(IN-)
$1N12908: R16.2 R17.1 R18.2 U6.4(IN-)
$1N20167: C1.2 C3.1 R1.2 R2.2 U1.2 U2.3
$1N20346: R2.1 R3.2
$1N20539: C3.2 K1.4 R1.1
$1N22217: R19.2 R20.1 U7.4(IN-)
$1N22283: R18.1 R20.2 U7.1(OUT)
$6N4438: R31.2 R32.2 U9.2
$6N4445: C17.2 K2.2 R23.1 R30.2 U8.1
$6N4470: D3.1(C) D4.2(A) K2.3 U10.3(IN+)
$6N4490: R35.2 U12.1(OUT) U13.3(IN+)
$6N4491: R33.1 R37.2 U13.1(OUT)
$6N4495: R34.2 R35.1 U12.4(IN-)
$6N4496: R36.2 R37.1 R38.2 U13.4(IN-)
$6N4497: C14.2 C16.1 R21.2 R22.2 U8.2 U9.3
$6N4505: R22.1 R23.2
$6N4507: C16.2 K2.4 R21.1
$6N4545: R39.2 R40.1 U14.4(IN-)
$6N4553: R38.1 R40.2 U14.1(OUT)
$7N1925: C31.1 U15.3(CFLY-)
$7N1932: C31.2 U15.6(CFLY+)

Not connected (* = marked no-connect by the designer): K1 5* 6* 7*; K2 5* 6* 7*; U4 4(Y7) 5(Y5); U11 1(Y4) 2(Y6)

## Notes on the sheets
sheet 1
- Vin
- 1.0V/20mV
- 500mV/10mV
- 2.0V/(40mV)
- (2.5V)/50mV
- 5V/100mV
- 10V/200mV
- Vout
- 500mV*gain=125mV
- gain=0.25
- Vout=0.206VIN+VP
- VP
sheet 2
- Vin
- 500mV/10mV
- 1.0V/20mV
- 2.0V/(40mV)
- (2.5V)/50mV
- 5V/100mV
- 10V/200mV
- Vout
- 500mV*gain=125mV
- gain=0.25
- Vout=0.206Vin+VP
- VP

# Board 示波器通道
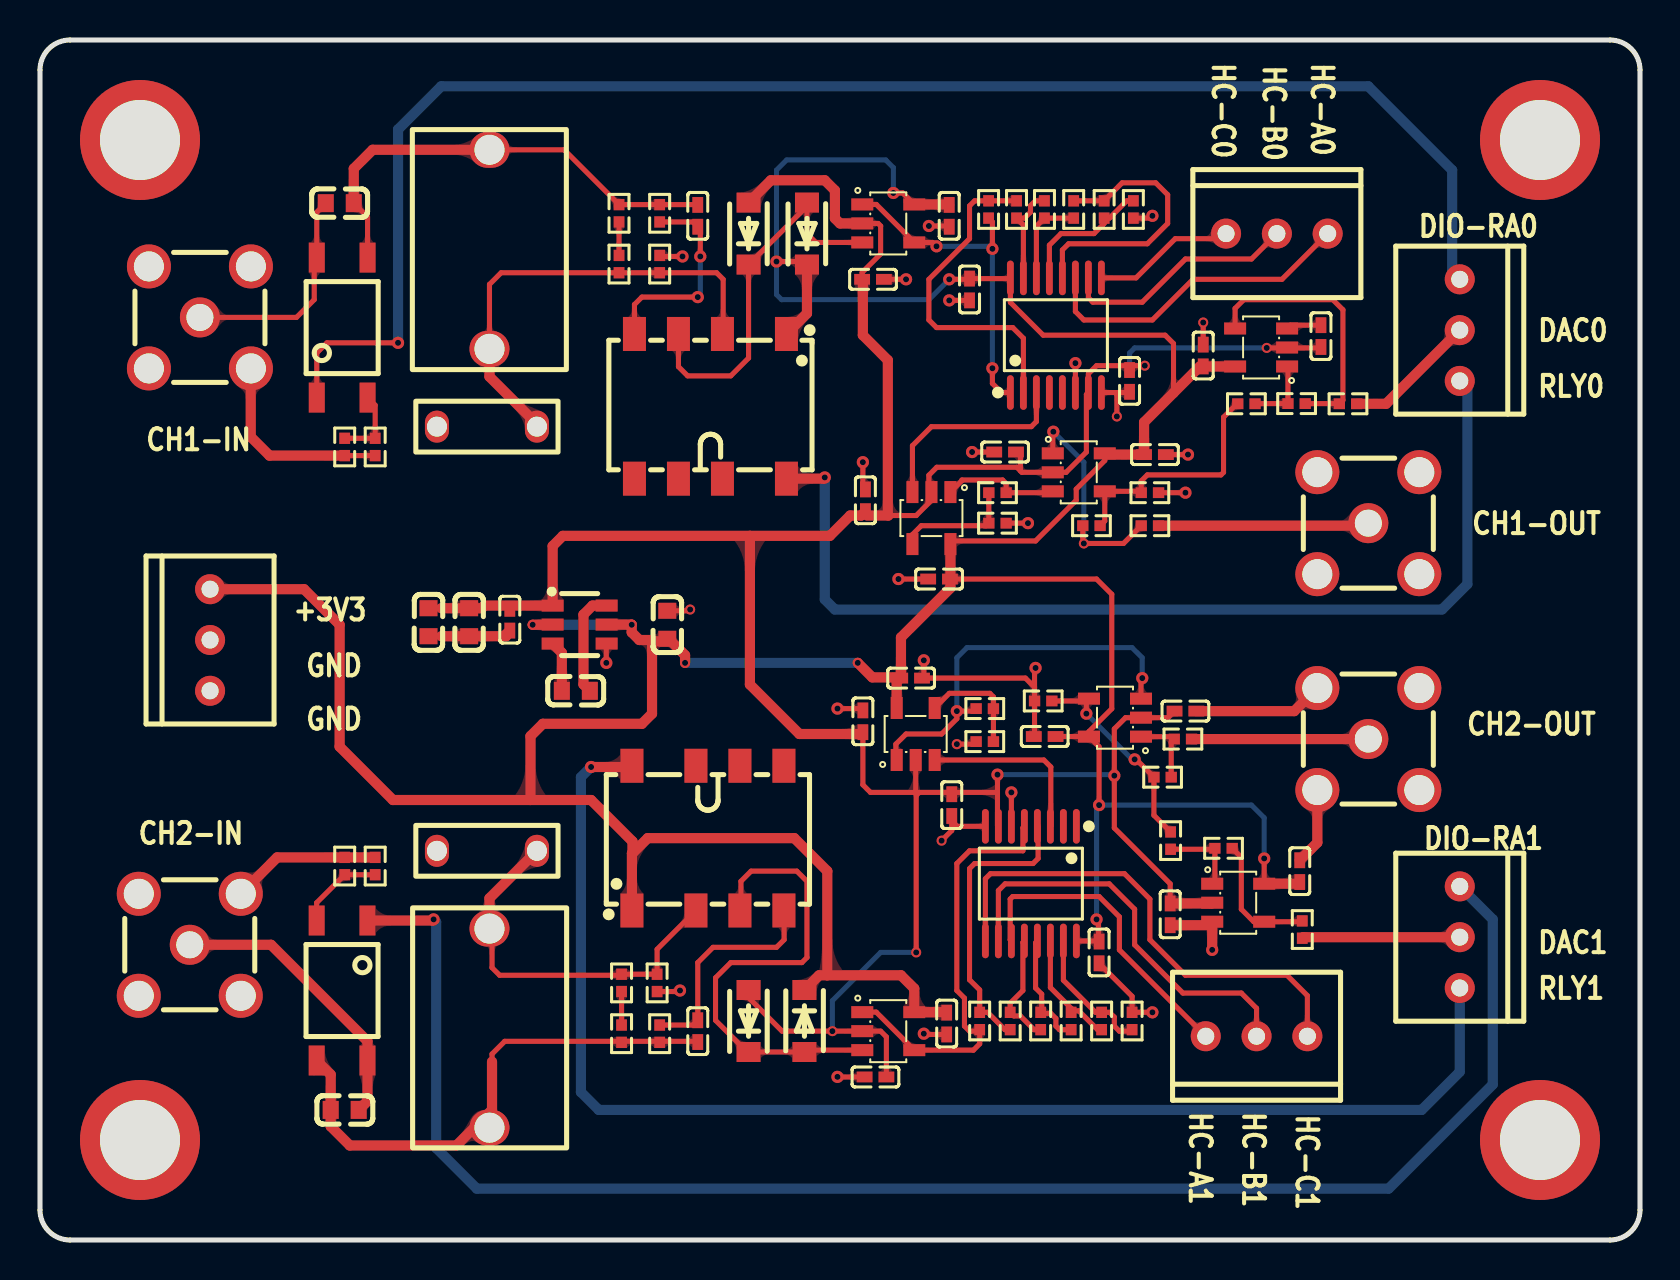
[diagram p3: board, top side]
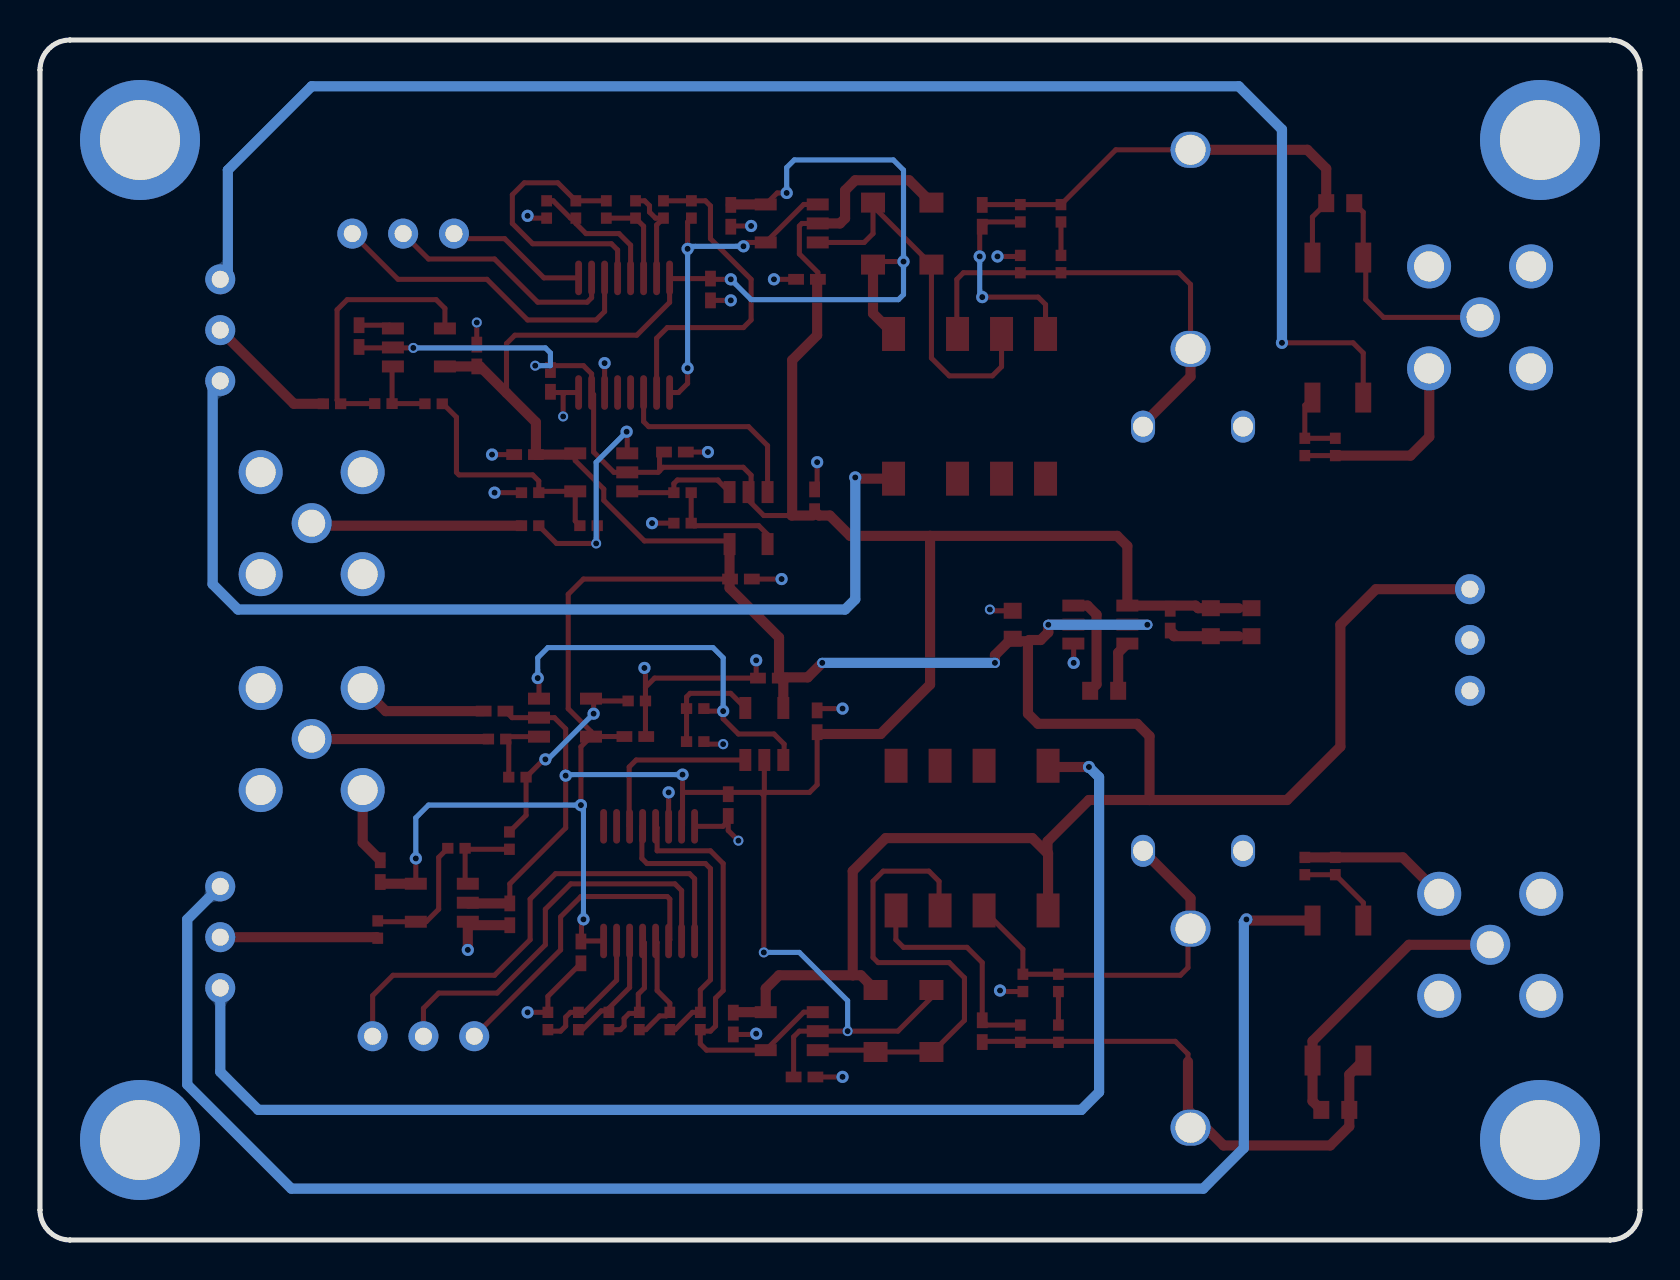
[diagram p4: board, bottom side, seen from below]

Outline 80 x 60 mm; copper layers: Top Layer, Bottom Layer. Coordinates in mm from the lower left corner of the outline.
Outline path: 0,58.5 0,1.5 arc(0.44,0.44) 1.5,0 78.5,0 arc(79.56,0.44) 80,1.5 80,58.5 arc(79.56,59.56) 78.5,60 1.5,60 arc(0.44,59.56) 0,58.5
Stack: Top Layer 0.035mm / Dielectric1 1.51mm FR4 er 4.5 / Bottom Layer 0.035mm

## Design rules (mm)
template: 自定义配置
spacing copperThickness1oz (default): track to track 0.203, other pairs 0.203 to 0.203
spacing copperThickness2oz: track to track 0.203, other pairs 0.152 to 0.3
track width copperThickness1oz (default): min 0.127, default 0.254, max 2.54
track width copperThickness2oz: min 0.203, default 0.254, max 2.54
track width trackWidth1: min 0.254, default 0.762, max 2.54
differential pair differentialPair (default): width min 0.127, default 0.254, max 2.54; gap min 0.152, default 0.152
via viaSize (default): diameter min 0.5, default 0.61, max 10; hole min 0.3, default 0.305, max 6.299
net GND uses trackWidth1
net +3V3 uses trackWidth1

## Placement (name value [footprint] x y rotation side)
C1  22nF  [C0603]  14.99 51.84 0 top
C2  100nF  [C0402]  41.65 48.03 0 top
C3  10nF  [C0402]  32.89 51.21 270 top
C4  120P  [280*100mil]  22.35 40.67 0 top
C5  100nF  [C0402]  45.46 51.21 270 top
C6  100nF  [C0402]  46.48 47.53 90 top
C7  100nF  [C0402]  41.27 36.98 90 top
C8  100nF  [C0402]  48.25 39.4 180 top
C9  100nF  [C0402]  54.48 42.95 90 top
C10  100nF  [C0402]  64.05 45.2 90 top
C11  100nF  [C0402]  44.95 33.05 180 top
C12  100nF  [C0402]  55.75 39.27 0 top
C13  100nF  [C0402]  58.16 44.22 90 top
C14  22nF  [C0603]  15.23 6.5 180 top
C15  100nF  [C0402]  41.77 8.15 180 top
C16  10nF  [C0402]  32.89 10.44 90 top
C17  120P  [280*100mil]  22.35 19.46 0 top
C18  100nF  [C0402]  45.33 10.82 270 top
C19  100nF  [C0402]  52.95 14.38 90 top
C20  100nF  [C0402]  41.14 25.94 90 top
C21  100nF  [C0402]  57.27 26.44 0 top
C22  100nF  [C0402]  45.59 21.75 90 top
C23  100nF  [C0402]  56.51 16.28 270 top
C24  100nF  [C0402]  43.56 28.09 0 top
C25  100nF  [C0402]  50.23 25.17 180 top
C26  100nF  [C0402]  62.99 18.44 90 top
C27  22uF  [C0603]  21.46 30.89 90 top
C28  22uF  [C0603]  19.43 30.89 90 top
C29  22uF  [C0603]  31.36 30.76 270 top
C30  100nF  [C0402]  23.49 31.02 90 top
C31  3.3uF  [C0603]  26.79 27.46 0 top
D1  SM4007PL  [SOD-123F_L2.8-W1.8-LS3.7-RD]  35.43 50.32 90 top
D2  SM4007PL  [SOD-123F_L2.8-W1.8-LS3.7-RD]  38.35 50.32 90 top
D3  SM4007PL  [SOD-123F_L2.8-W1.8-LS3.7-RD]  35.43 10.95 90 top
D4  SM4007PL  [SOD-123F_L2.8-W1.8-LS3.7-RD]  38.22 10.95 270 top
J1  -  [CH2.54-3插座]  70.99 45.49 270 top
J2  -  [CH2.54-3插座]  61.84 50.32 0 top
J3  -  [CH2.54-3插座]  70.99 15.14 270 top
J4  -  [CH2.54-3插座]  60.83 10.19 180 top
J5  -  [CH2.54-3插座]  8.5 30 90 top
K1  G6K-2F-Y DC3  [RELAY-SMD_G6K-2F-Y]  33.52 41.68 180 top
K2  G6K-2F-Y DC3  [RELAY-SMD_G6K-2F-Y]  33.4 20.09 0 top
NOREF  -  [Pad_e6664]  5 5 0 top
NOREF#2  -  [Pad_e6661]  75 55 0 top
NOREF#3  -  [Pad_e6665]  75 5 0 top
NOREF#4  -  [Pad_e6663]  5 55 0 top
R1  510kΩ  [R0402]  30.98 51.34 90 top
R2  510kΩ  [R0402]  28.95 51.34 90 top
R3  470kΩ  [R0402]  28.95 48.8 90 top
R4  49.9Ω  [R0402]  47.43 51.53 90 top
R5  24.9Ω  [R0402]  48.83 51.53 270 top
R6  4.99Ω  [R0402]  50.22 51.53 270 top
R7  10Ω  [R0402]  51.68 51.53 90 top
R8  4.99Ω  [R0402]  53.21 51.53 270 top
R9  4.99Ω  [R0402]  54.67 51.53 270 top
R10  20kΩ  [R0402]  30.98 48.8 270 top
R11  1kΩ  [R0402]  15.23 39.65 90 top
R12  1kΩ  [R0402]  16.76 39.65 90 top
R13  22Ω  [R0402]  55.49 35.72 0 top
R14  82Ω  [R0402]  47.87 35.84 180 top
R15  180Ω  [R0402]  47.87 37.37 0 top
R16  180Ω  [R0402]  55.49 37.37 180 top
R17  220Ω  [R0402]  52.57 35.72 180 top
R18  220Ω  [R0402]  60.32 41.81 180 top
R19  220Ω  [R0402]  65.4 41.81 180 top
R20  220Ω  [R0402]  62.83 41.82 180 top
R21  510kΩ  [R0402]  30.98 10.31 270 top
R22  510kΩ  [R0402]  29.08 10.31 270 top
R23  470kΩ  [R0402]  29.08 12.86 270 top
R24  49.9Ω  [R0402]  46.98 10.95 90 top
R25  24.9Ω  [R0402]  48.51 10.95 90 top
R26  4.99Ω  [R0402]  50.03 10.95 90 top
R27  10Ω  [R0402]  51.56 10.95 90 top
R28  4.99Ω  [R0402]  53.08 10.95 90 top
R29  4.99Ω  [R0402]  54.6 10.95 90 top
R30  20kΩ  [R0402]  30.86 12.86 90 top
R31  1kΩ  [R0402]  15.23 18.7 270 top
R32  1kΩ  [R0402]  16.76 18.7 270 top
R33  22Ω  [R0402]  57.15 25.05 0 top
R34  82Ω  [R0402]  47.24 24.92 0 top
R35  180Ω  [R0402]  47.24 26.57 180 top
R36  180Ω  [R0402]  50.16 26.95 0 top
R37  220Ω  [R0402]  56.13 23.14 0 top
R38  220Ω  [R0402]  56.53 19.97 90 top
R39  220Ω  [R0402]  63.11 15.52 90 top
R40  220Ω  [R0402]  59.18 19.59 180 top
RF1  BWSMA-KE-Z001  [SMA-TH_BWSMA-KE-Z001]  8 46.13 0 top
RF2  BWSMA-KE-Z001  [SMA-TH_BWSMA-KE-Z001]  66.42 35.84 180 top
RF3  BWSMA-KE-Z001  [SMA-TH_BWSMA-KE-Z001]  7.49 14.76 0 top
RF4  BWSMA-KE-Z001  [SMA-TH_BWSMA-KE-Z001]  66.42 25.05 0 top
U1  0-50uf  [可调电容]  22.47 49.56 90 top
U2  TLP172GM(TPL,E(O  [SMD-4_L4.6-W3.7-P2.54-LS7.0-BR]  15.11 45.62 270 top
U3  GS8091-TR  [SOT-23-5_L3.0-W1.7-P0.95-LS2.8-BR]  42.41 50.83 180 top
U4  74HC4051PW,118  [TSSOP-16_L5.0-W4.4-P0.65-LS6.4-BL]  50.79 45.24 0 top
U5  GS8091-TR  [SOT-23-5_L3.0-W1.7-P0.95-LS2.8-BR]  44.57 36.1 90 top
U6  GS8091-TR  [SOT-23-5_L3.0-W1.7-P0.95-LS2.8-BR]  51.94 38.38 180 top
U7  GS8091-TR  [SOT-23-5_L3.0-W1.7-P0.95-LS2.8-BR]  61.05 44.63 0 top
U8  0-50uf  [可调电容]  22.47 10.57 270 top
U9  TLP172GM(TPL,E(O  [SMD-4_L4.6-W3.7-P2.54-LS7.0-BR]  15.1 12.47 90 top
U10  GS8091-TR  [SOT-23-5_L3.0-W1.7-P0.95-LS2.8-BR]  42.41 10.44 180 top
U11  74HC4051PW,118  [TSSOP-16_L5.0-W4.4-P0.65-LS6.4-BL]  49.54 17.82 180 top
U12  GS8091-TR  [SOT-23-5_L3.0-W1.7-P0.95-LS2.8-BR]  43.78 25.3 270 top
U13  GS8091-TR  [SOT-23-5_L3.0-W1.7-P0.95-LS2.8-BR]  53.75 26.12 0 top
U14  GS8091-TR  [SOT-23-5_L3.0-W1.7-P0.95-LS2.8-BR]  59.91 16.86 180 top
U15  SGM3204YN6G/TR  [SOT-23-6_L2.9-W1.6-P0.95-LS2.8-BR]  26.98 30.77 180 top

## Footprints (pads in the part's own frame, mm; a bottom-side part is the same pattern mirrored in y, then rotated)
280*100mil
  oval 1.2x1.6 hole 1x0.8: 1(-2.5,0) 2(2.5,0)
C0402
  rect 0.79x0.54 smd: 1(-0.545,0) 2(0.545,0)
C0603
  rect 0.8x0.9 smd: 1(-0.7,0) 2(0.7,0)
CH2.54-3插座
  round 1.5 hole 0.85: 1(-2.54,0) 2(0,0) 3(2.54,0)
Pad_e6661
  round 6 hole 4: 2(0,0)
Pad_e6663
  round 6 hole 4: 1(0,0)
Pad_e6664
  round 6 hole 4: 3(0,0)
Pad_e6665
  round 6 hole 4: 4(0,0)
R0402
  rect 0.566x0.54 smd: 1(-0.433,0) 2(0.433,0)
RELAY-SMD_G6K-2F-Y
  rect 1.15x1.7 smd: 1(-3.8,-3.618) 2(-0.6,-3.618) 3(1.6,-3.618) 4(3.8,-3.618) 5(3.8,3.618) 6(1.6,3.618) 7(-0.6,3.618) 8(-3.8,3.618)
SMA-TH_BWSMA-KE-Z001
  round 2.2 hole 1.5: 1(-2.55,-2.55) 2(-2.55,2.55) 3(2.55,2.55) 4(2.55,-2.55)
  round 2 hole 1.35: 5(0,0)
SMD-4_L4.6-W3.7-P2.54-LS7.0-BR
  rect 1.5x0.8 smd: 1(3.5,-1.27) 2(3.5,1.27) 3(-3.5,1.27) 4(-3.5,-1.27)
SOD-123F_L2.8-W1.8-LS3.7-RD
  rect 1x1.2 smd: 1(-1.55,0) 2(1.55,0)
SOT-23-5_L3.0-W1.7-P0.95-LS2.8-BR
  rect 1.1x0.6 smd: 1(1.3,-0.95) 2(1.3,0) 3(1.3,0.95) 4(-1.3,0.95) 5(-1.3,-0.95)
SOT-23-6_L2.9-W1.6-P0.95-LS2.8-BR
  rect 1.1x0.6 smd: 1(1.35,-0.95) 2(1.35,0) 3(1.35,0.95) 4(-1.35,0.95) 5(-1.35,0) 6(-1.35,-0.95)
TSSOP-16_L5.0-W4.4-P0.65-LS6.4-BL
  oval 0.343x1.732 smd: 1(-2.275,-2.866) 2(-1.625,-2.866) 3(-0.975,-2.866) 4(-0.325,-2.866) 5(0.325,-2.866) 6(0.975,-2.866) 7(1.625,-2.866) 8(2.275,-2.866) 9(2.275,2.866) 10(1.625,2.866) 11(0.975,2.866) 12(0.325,2.866) 13(-0.325,2.866) 14(-0.975,2.866) 15(-1.625,2.866) 16(-2.275,2.866)
可调电容
  oval 1.8x2 hole 1.5: 1(-5,0) 2(4.953,0)

## Nets
As in the schematic, except:
GND: C2.2 C4.1 C5.2 C6.1 C7.2 C8.2 C9.1 C10.2 C11.2 C12.2 C13.2 C15.2 C17.1 C18.2 C19.1 C20.2 C21.2 C22.1 C23.2 C24.2 C25.2 C26.2 C27.1 C28.1 C29.1 C30.1 J5.1 J5.2 NOREF.3 NOREF#2.2 NOREF#3.4 NOREF#4.1 R9.2 R10.1 R11.1 R12.1 R14.1 R16.1 R29.2 R30.1 R31.1 R32.1 R34.1 R36.1 RF1.1 RF1.2 RF1.3 RF1.4 RF2.1 RF2.2 RF2.3 RF2.4 RF3.1 RF3.2 RF3.3 RF3.4 RF4.1 RF4.2 RF4.3 RF4.4 U4.6 U4.8 U7.3 U11.6 U11.8 U14.3 U15.4
INPUT1: C1.1 RF1.5 U2.4
INPUT2: C14.1 RF3.5 U9.4

Pads without a net: K1 5 6 7; K2 5 6 7; U4 4 5; U11 1 2

## Via types
v1: diameter 0.61, hole 0.305, Top Layer to Bottom Layer, 44 vias
v2: diameter 0.5, hole 0.305, Top Layer to Bottom Layer, 13 vias
v3: diameter 0.51, hole 0.305, Top Layer to Bottom Layer, 1 via

## Routing (per net, layer and track width the routed paths; a pad name or vN(x,y) marks a point on that pad's centre or on a via; arc(x,y) is an arc through that point)
+3V3: length 212.9
  Top Layer w0.254: v2(24.63,30.76) 24.62,30.77 24.51,30.77 ; U13.5 52.95,24.66 v1(52.95,21.75) ; U13.5 52.44,25.17 C25.1 ; U13.5 52.45,25.42 53.59,26.56 53.59,32.29 52.83,33.05 45.52,33.05 ; U11.16 52.93,14.95 ; 52.93,14.95 C19.2 ; 52.93,14.95 52.93,15.93 v1(52.83,16.03) ; U14.5 61.21,19.08 ; 43.71,51.78 43.14,52.35 v1(42.67,52.35) ; 30.54,30 30.6,30.06 ; D2.1 38.2,48.92 v1(36.82,48.92) ; 56.68,42.36 56.68,44.82 56.26,45.24 50.16,45.24 48.52,46.88 U4.16 48.49,48.07 C6.2 46.44,48.03 v1(45.46,48.03) ; U6.5 53.24,38.97 51.81,37.55 51.81,36.98 49.78,34.95 45.68,34.95 U5.5
  Top Layer w0.508: U6.5 53.3,39.27 C12.1 55.2,40.89 58,43.68 C13.1 59.75,43.68 U7.5 ; 39.36,13.24 39.37,13.25 39.37,18.44 37.71,20.09 30.39,20.09 29.62,19.33 ; 39.36,13.24 43.05,13.24 43.71,12.57 43.71,11.39 45.31,11.39 C18.1 ; 39.36,13.24 38.96,13.24 D4.1 ; v2(40.89,28.86) 41.61,28.13 43.05,28.13 ; D2.1 38.35,46.33 K1.1 ; 43.05,28.13 C24.1 42.83,27.92 U12.5 ; 43.05,28.13 43.05,30.13 45.52,32.6 45.52,33.07 ; C26.1 62.9,17.81 U14.5 ; 29.62,19.33 29.62,19.93 27.55,22 24.52,22 ; 29.62,19.33 29.6,19.33 K2.1 ; 30.6,29.94 30.6,26.32 30.09,25.81 25.14,25.81 24.52,25.19 24.52,22 ; 30.6,29.94 30.54,30 29.97,30 29.59,30.38 v2(29.59,30.76) 29.58,30.77 U15.5 ; 30.6,29.94 31.55,29.94 32.25,29.24 v2(32.25,28.86) ; 45.52,33.07 U5.5 ; 45.52,33.07 C11.1 ; U15.2 25.62,30.76 v2(24.63,30.76) ; 24.52,22 17.65,22 14.98,24.67 14.98,30.76 13.2,32.54 J5.3 ; C5.1 45.44,51.78 43.71,51.78
  Bottom Layer w0.254: v1(45.46,48.03) 44.44,47.02 37.08,47.02 36.82,47.27 v1(36.82,48.92) 36.82,53.5 37.33,54 42.29,54 42.67,53.62 v1(42.67,52.35) ; v1(61.21,19.08) 61.21,21.11 60.57,21.75 v1(52.95,21.75) 52.83,21.62 v1(52.83,16.03)
  Bottom Layer w0.508: v2(40.89,28.86) v2(32.25,28.86) ; v2(29.59,30.76) v2(24.63,30.76)
-3V3: length 156.1
  Top Layer w0.254: v2(61.34,44.61) 64,44.61 C10.1 ; C20.1 41.14,22.76 41.52,22.38 43.73,22.38 ; 47.87,22.38 47.87,20.73 U11.7 ; 47.87,22.38 v1(47.87,23.27) ; 47.87,22.38 45.68,22.38 ; 49.02,38.46 49.1,38.38 U6.2 51.3,38.38 52.32,39.4 52.32,42.27 U4.7 52.42,43.31 52.83,43.72 54.39,43.72 ; 49.02,38.46 48.84,38.64 44.84,38.64 44.44,38.24 44.44,37.52 U5.2 44.57,36.98 43.81,36.22 42.41,36.22 ; 49.02,38.46 49.02,39.4 C8.1 ; U12.2 43.78,22.43 43.73,22.38 ; C21.1 56.4,26.12 U13.2 54.28,26.12 53.72,25.56 v1(53.72,23.22) 53.72,20.6 56.51,17.81 56.51,16.83 ; 54.39,43.72 54.6,43.5 ; 54.39,43.72 v2(55.24,43.72) ; v2(43.81,14.38) 43.81,22.23 43.96,22.38 ; 43.73,22.38 43.96,22.38 ; C2.1 41.11,48.38 42.03,49.3 42.03,50.7 41.91,50.83 U3.2 ; 35.05,12.5 37.1,10.44 v2(39.62,10.44) U10.2 42.03,10.44 42.32,10.16 C15.1 ; 43.96,22.38 45.5,22.38
  Top Layer w0.508: 35.5,35.21 39.49,35.21 40.51,36.22 41.05,36.22 C7.1 ; 35.5,35.21 35.5,27.77 37.97,25.3 41.05,25.3 C20.1 ; 35.5,35.21 26.14,35.21 25.63,34.7 U15.1 22.22,31.72 22.09,31.59 C27.2 20.06,31.59 ; U3.2 40,50.83 39.75,51.08 39.75,52.48 39.24,52.99 36.54,52.99 D1.2 ; C2.1 41.14,48 41.14,45.24 42.39,43.99 42.39,36.24 42.41,36.22 41.36,36.22 ; 56.51,16.83 58.57,16.83 U14.2
  Bottom Layer w0.254: v1(53.72,23.22) 53.66,23.27 v1(47.87,23.27) ; v2(39.62,10.44) 39.62,11.97 42.03,14.38 v2(43.81,14.38) ; v2(55.24,43.72) 54.48,43.72 54.48,44.35 54.73,44.61 v2(61.34,44.61)
GND: length 82
  Top Layer w0.254: v3(45.84,24.79) 46.68,24.79 ; C12.2 v1(57.4,39.27) ; U4.6 v1(51.77,43.84) ; C22.1 45.59,20.95 ; 45.59,20.95 45.85,20.68 47.27,20.68 ; 45.59,20.95 45.59,20.47 v2(45.08,19.97) ; C11.2 v1(42.92,33.05) ; 49.73,27.64 49.27,28.09 C24.2 44.19,28.19 v1(44.19,28.98) ; 49.73,27.64 R36.1 49.73,25.21 49.69,25.17 ; 49.73,27.64 49.73,28.55 v1(49.78,28.6) ; R9.2 55.51,51.09 v1(55.62,51.21) ; C10.2 62.52,45.74 U7.3 ; 28.28,29.82 28.32,29.79 v1(28.32,28.86) ; v2(32.51,31.52) 32.44,31.46 C29.1 ; v1(43.3,48.03) C2.2 ; 41.14,37.53 v1(41.14,38.89) ; v1(55.62,11.38) 54.6,11.38 54.6,12.18 C19.1 ; v2(53.84,41.18) 53.84,42.28 53.75,42.37 ; R14.1 v1(49.4,35.84) ; 53.75,42.37 54.57,42.37 54.6,42.41 ; 53.75,42.37 U4.8 ; v1(44.44,50.7) 45.42,50.7 C5.2 ; C13.2 v2(58.16,45.88) ; 57.27,37.49 57.15,37.37 R16.1 ; v1(39.87,8.16) 39.88,8.15 C15.2 ; 41.14,26.48 41.05,26.57 v1(39.87,26.57) ; 30.98,49.23 31.03,49.18 v1(32.13,49.18) ; C8.2 v1(46.6,39.4) ; C18.2 44.32,10.28 ; C6.1 v1(45.46,46.98) ; R30.1 31.87,12.42 ; 48.57,20.68 v1(48.57,22.38) ; R11.1 R12.1
  Top Layer w0.508: C26.2 63.87,19.87 RF4.1 ; R32.1 R31.1 11.86,19.13 RF3.3 ; RF4.2 62.71,26.44 C21.2 ; C30.1 23.3,30.29 23.3,30.19 C27.1 20.06,30.19 ; C23.2 58.43,15.74 U14.3 v1(58.61,14.51) ; RF1.4 10.54,43.57 10.54,40.16 11.48,39.22 R11.1
  vias: v1(32,12.47) v1(44.19,10.31) v1(57.27,37.37)
CH1-0: length 16.9
  Top Layer w0.254: R4.1 47.62,50.9 v1(47.62,49.56) ; v1(44.83,49.69) 44.63,49.88 43.71,49.88 41.81,51.78 U3.1 ; U4.1 48.07,42.37 47.62,42.83 v1(47.62,43.59)
  Bottom Layer w0.254: v1(47.62,43.59) v1(47.62,49.56) 47.49,49.69 v1(44.83,49.69)
CH1-1: length 16.8
  Top Layer w0.254: U4.2 49.17,45.09 48.64,45.62 44.83,45.62 44.44,46 44.44,48.03 46.48,50.07 46.48,51.71 46.73,51.96 R4.2 R5.1
CH1-2: length 5.1
  Top Layer w0.254: R6.1 49.77,51.96 49.53,51.72 49.53,51.39 49.22,51.09 R5.2 49.17,50.75 U4.15
CH1-3: length 4.6
  Top Layer w0.254: U4.14 49.82,50.69 R6.2 R7.1
CH1-4: length 14
  Top Layer w0.254: U4.12 51.12,49.5 51.43,49.81 55.37,49.81 56.38,50.83 56.38,52.26 55.78,52.86 54.11,52.86 R8.1 R7.2
CH1-5: length 6.9
  Top Layer w0.254: U4.13 50.47,49.74 51.05,50.32 52.7,50.32 53.21,50.83 R8.2 53.47,51.09 54.34,51.96 R9.1
CH1-OUT: length 10.5
  Top Layer w0.508: R13.2 66.29,35.72 RF2.5
CH2-0: length 21.5
  Top Layer w0.254: U11.5 49.14,20.61 49.14,19.46 46.48,19.46 45.84,18.82 45.84,12.47 46.22,12.09 46.22,10.7 46.48,10.44 46.91,10.44 R24.1 46.99,10.51 46.99,9.81 46.67,9.49 43.71,9.49 41.81,11.39 U10.1
CH2-1: length 14.5
  Top Layer w0.254: R25.1 48.25,10.52 47.38,11.38 46.98,11.38 46.98,12.5 46.48,13.01 46.48,18.57 46.73,18.82 49.65,18.82 49.91,19.08 49.91,20.69
CH2-2: length 5.7
  Top Layer w0.254: R26.1 49.7,10.52 49.02,11.2 48.69,11.2 48.51,11.38 48.51,11.84 49.14,12.47 49.14,14.88 U11.12
CH2-3: length 5.9
  Top Layer w0.254: R27.1 50.97,10.52 50.79,10.7 50.79,11.08 50.54,11.33 50.09,11.33 ; 50.09,11.33 50.09,12.3 49.78,12.6 49.78,14.86 49.87,14.95 ; 50.09,11.33 50.03,11.38
CH2-4: length 5.9
  Top Layer w0.254: U11.14 50.52,12.62 51.56,11.59 51.56,11.38 51.63,11.46 51.94,11.46 52.88,10.52 R28.1
CH2-5: length 6.7
  Top Layer w0.254: U11.15 51.17,12.99 52.78,11.38 53.48,11.38 53.72,11.15 53.72,10.7 53.97,10.44 54.53,10.44 R29.1
CH2-OUT: length 8.8
  Top Layer w0.508: R33.2 RF4.5
DAC0: length 6.7
  Top Layer w0.508: R19.1 67.31,41.81 J1.2
DAC1: length 7.9
  Top Layer w0.508: R39.1 63.17,15.14 J3.2
DIO-RA0: length 78.1
  Top Layer w0.254: U2.1 13.84,44.35 14.35,44.86 v1(17.9,44.86)
  Bottom Layer w0.508: J1.1 70.61,48.42 70.61,53.5 66.42,57.69 20.06,57.69 17.9,55.53 v1(17.9,44.86)
DIO-RA1: length 81.2
  Top Layer w0.508: v1(19.68,16.03) 19.62,15.97 U9.1
  Bottom Layer w0.508: 70.99,17.68 72.64,16.03 72.64,7.78 67.43,2.57 21.84,2.57 19.81,4.6 19.81,15.9 v1(19.68,16.03)
HC-A0: length 16.3
  Top Layer w0.254: J2.3 62.1,48.03 57.65,48.03 55.62,46 52.19,46 51.77,46.42 U4.11
HC-A1: length 15.8
  Top Layer w0.254: 48.57,14.95 48.51,15.01 48.51,17.05 48.64,17.17 52.95,17.17 53.97,16.16 53.97,14.51 J4.3
HC-B0: length 11.9
  Top Layer w0.254: J2.2 60.57,49.05 57.27,49.05 55.11,46.89 52.64,46.89 52.42,47.11 U4.10
HC-B1: length 20.6
  Top Layer w0.254: J4.2 60.83,11.59 60.07,12.35 57.15,12.35 54.73,14.76 54.73,16.54 53.46,17.81 48.25,17.81 47.92,17.47 U11.10
HC-C0: length 7.2
  Top Layer w0.254: U4.9 54.8,48.11 56.76,50.07 59.05,50.07 J2.1
HC-C1: length 25.1
  Top Layer w0.254: 47.27,14.95 47.27,18.06 47.52,18.32 54.22,18.32 55.49,17.05 55.49,15.01 57.27,13.24 62.35,13.24 63.37,12.22 J4.1
INPUT1: length 11.1
  Top Layer w0.254: C1.1 13.84,51.39 U2.4 13.71,48.99 13.71,47.02 12.82,46.13 RF1.5
INPUT2: length 14.5
  Top Layer w0.508: C14.1 16.37,6.94 U9.4 16.37,9.94 11.55,14.76 RF3.5
OUT_HC0: length 10.5
  Top Layer w0.254: U4.3 49.82,40.92 49.57,40.67 44.57,40.67 43.62,39.72 U5.3
OUT_HC1: length 8.9
  Top Layer w0.254: U12.3 50.19,24 50.54,23.65 50.54,20.7 U11.3
RLY0: length 51.2
  Top Layer w0.508: v1(39.24,38.13) 39.18,38.07 K1.8
  Bottom Layer w0.508: v1(39.24,38.13) 39.24,32.03 39.75,31.52 70.1,31.52 71.37,32.79 71.37,42.57 J1.3
RLY1: length 67.8
  Top Layer w0.508: v1(27.55,23.65) 29.53,23.65 K2.8
  Bottom Layer w0.508: J3.3 70.99,8.41 69.08,6.5 27.94,6.5 27.05,7.39 27.05,23.14 v1(27.55,23.65)
$1N1760: length 3.7
  Top Layer w0.254: 15.23,40.08 16.76,40.08 16.76,41.74 U2.2
$1N2407: length 23.1
  Top Layer w0.254: U1.1 22.47,47.78 23.06,48.36 R3.1 R10.2 33.83,48.36 34.16,48.03 34.16,45.34 K1.2
  Top Layer w0.508: 25.1,40.54 22.47,43.17 U1.1
$1N11061: length 19
  Top Layer w0.254: 38.35,51.69 D2.2 ; 38.35,51.69 D1.1 35.43,44.1 34.54,43.21 32.38,43.21 31.92,43.67 K1.3 ; 38.35,51.69 38.35,50.32 38.79,49.88 U3.3
$1N11884: length 5.9
  Top Layer w0.254: U5.1 46.1,37.97 46.1,38 48.13,38 48.31,37.82 R15.2 50.57,37.37 U6.3
$1N12026: length 11.5
  Top Layer w0.254: v1(50.67,40.41) 50.64,40.38 U6.1 ; R17.2 52.14,34.88 v2(52.19,34.83) 54.17,34.83 R13.1
  Bottom Layer w0.254: v2(52.19,34.83) 52.19,38.89 v1(50.67,40.41)
$1N12901: length 6.1
  Top Layer w0.254: U5.4 43.62,35.27 44.06,35.72 47.31,35.72 R14.2 R15.1
$1N12908: length 12.3
  Top Layer w0.254: R17.1 53.24,35.95 U6.4 55,37.43 R16.2 55.06,37.95 55.37,38.25 59.05,38.25 59.18,38.38 59.18,41.14 59.86,41.82
$1N20167: length 23.5
  Top Layer w0.254: C3.1 32.87,51.77 R1.2 R2.2 26.21,54.51 U1.2 ; U2.3 16.38,51.15 C1.2
  Top Layer w0.508: C1.2 15.69,53.57 16.63,54.51 U1.2
$1N20346: length 1.7
  Top Layer w0.254: 28.95,49.23 28.95,50.9
$1N20539: length 10.4
  Top Layer w0.254: 30.98,50.9 32.65,50.9 C3.2 33.01,50.54 v1(33.01,49.18) ; 29.72,45.3 29.72,46.77 30.09,47.14 v1(32.89,47.14)
  Bottom Layer w0.254: v1(33.01,49.18) 33.01,47.27 v1(32.89,47.14)
$1N22217: length 13.3
  Top Layer w0.254: R20.1 64.96,41.82 R19.2 65.15,41.99 65.15,46.51 64.64,47.02 60.19,47.02 59.75,46.58 U7.4
$1N22283: length 3.5
  Top Layer w0.254: 60.72,41.82 R20.2 62.4,43.63 U7.1
$6N4438: length 4.4
  Top Layer w0.254: U9.2 13.83,16.86 R31.2 R32.2
$6N4445: length 19.9
  Top Layer w0.254: K2.2 30.86,14.54 R30.2 R23.1 29.03,13.24 22.98,13.24 22.6,13.62 22.6,16.2
  Top Layer w0.508: U8.1 22.47,17.09 C17.2
$6N4470: length 24.5
  Top Layer w0.254: U10.3 38.31,9.49 D4.2 35.36,9.4 ; 35.36,9.4 35.05,9.4 ; 35.36,9.4 33.78,10.98 33.78,13.11 34.54,13.87 38.09,13.87 38.35,14.12 38.35,17.94 37.84,18.44 35.56,18.44 35.05,17.94 35.05,16.53 K2.3
$6N4490: length 20.2
  Top Layer w0.254: v1(55.11,28.09) 55.05,28.03 U13.3 ; 46.81,26.44 v1(45.84,26.44) 45.84,26.06 45.08,25.3 43.3,25.3 42.79,24.79 42.79,24.04 U12.1
  Bottom Layer w0.254: v1(55.11,28.09) 55.11,29.11 54.6,29.62 46.35,29.62 45.84,29.11 v1(45.84,26.44)
$6N4491: length 3.7
  Top Layer w0.254: U13.1 56.59,25.17 R33.1 56.56,24.9 R37.2
$6N4495: length 5.5
  Top Layer w0.254: U12.4 45.47,27.33 47.49,27.33 47.67,27.15 R35.1 R34.2
$6N4496: length 10.3
  Top Layer w0.254: U13.4 52.33,26.95 ; 52.33,26.95 52.32,26.94 v1(52.32,26.32) ; 52.33,26.95 R36.2 ; R38.2 55.7,21.24 R37.1 54.81,24.03 v1(54.73,24.03)
  Bottom Layer w0.254: v1(54.73,24.03) 54.6,24.03 v1(52.32,26.32)
$6N4497: length 26.1
  Top Layer w0.254: 32.89,9.9 32.85,9.93 23.24,9.93 22.6,9.3 22.6,8.92
  Top Layer w0.508: 22.6,8.92 22.6,6.5 20.82,4.73 15.49,4.73 14.53,5.68 C14.2 14.53,8.27 U9.3
$6N4505: length 1.7
  Top Layer w0.254: R22.1 R23.2
$6N4507: length 11.1
  Top Layer w0.254: K2.4 37.21,16.47 37.21,15.01 36.82,14.63 33.65,14.63 32.89,13.87 C16.2 32.65,10.75 R21.1
$6N4545: length 6.6
  Top Layer w0.254: R39.2 63.07,15.91 U14.4 60.69,15.91 60.07,16.54 60.07,19.13 R40.1
$6N4553: length 4.1
  Top Layer w0.254: U14.1 58.74,17.95 R40.2 58.69,19.54 R38.1
$7N1925: length 2.6
  Top Layer w0.508: U15.3 26.09,29.36 C31.1
$7N1932: length 5.3
  Top Layer w0.508: C31.2 27.17,27.78 27.17,31.27 27.62,31.72 U15.6

## Copper pours and planes (outline as drawn; the poured copper is in the pictures)
GND on Top Layer: -4.7,62.39 82.42,62.39 82.42,-2.64 -4.7,-2.64
GND on Bottom Layer: -5.59,61.62 81.66,61.62 81.66,-2.13 -5.59,-2.13

Small or netless copper shapes (teardrops, artwork), in the pictures only: 387 on Top Layer, 30 on Bottom Layer

## Text on the board
Top Silkscreen Layer: CH2-IN | CH1-IN | +3V3 | GND | CH2-OUT | CH1-OUT | HC-A1 | HC-C0 | HC-B1 | HC-B0 | HC-C1 | HC-A0 | DIO-RA0 | DIO-RA1 | DAC0 | RLY0 | DAC1 | RLY1
